# EAGLE schematic BEP32_6stencil_Seed_wMilling (EAGLE 6.4), part 3 of 4
## Sheet 9 of 12
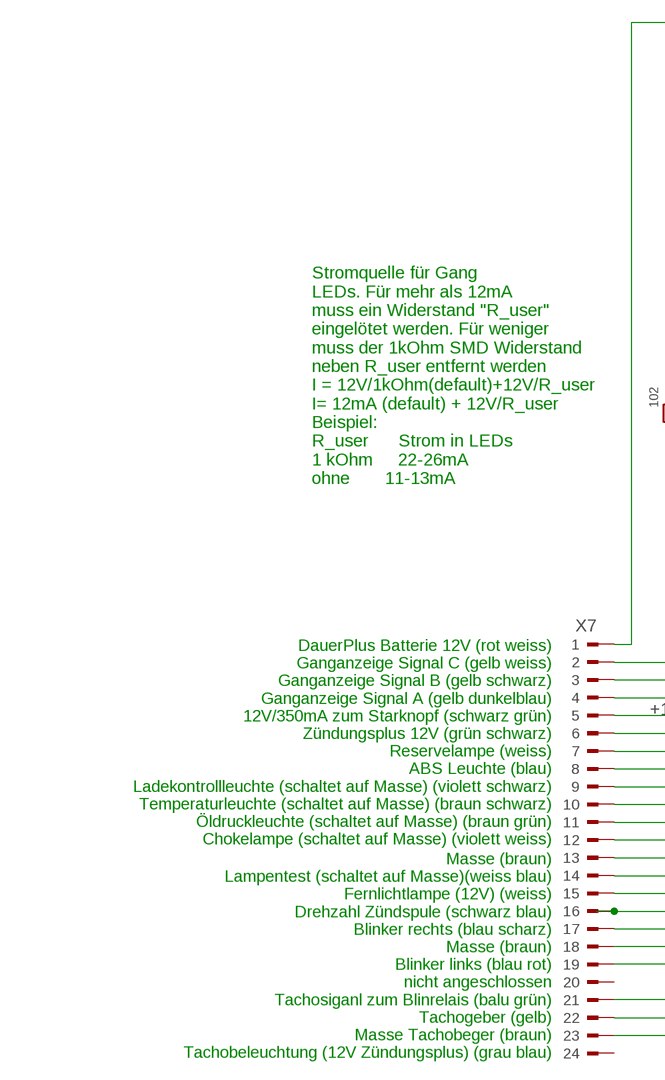
[diagram p16: schematic, sheet 9, part 1 of 2]
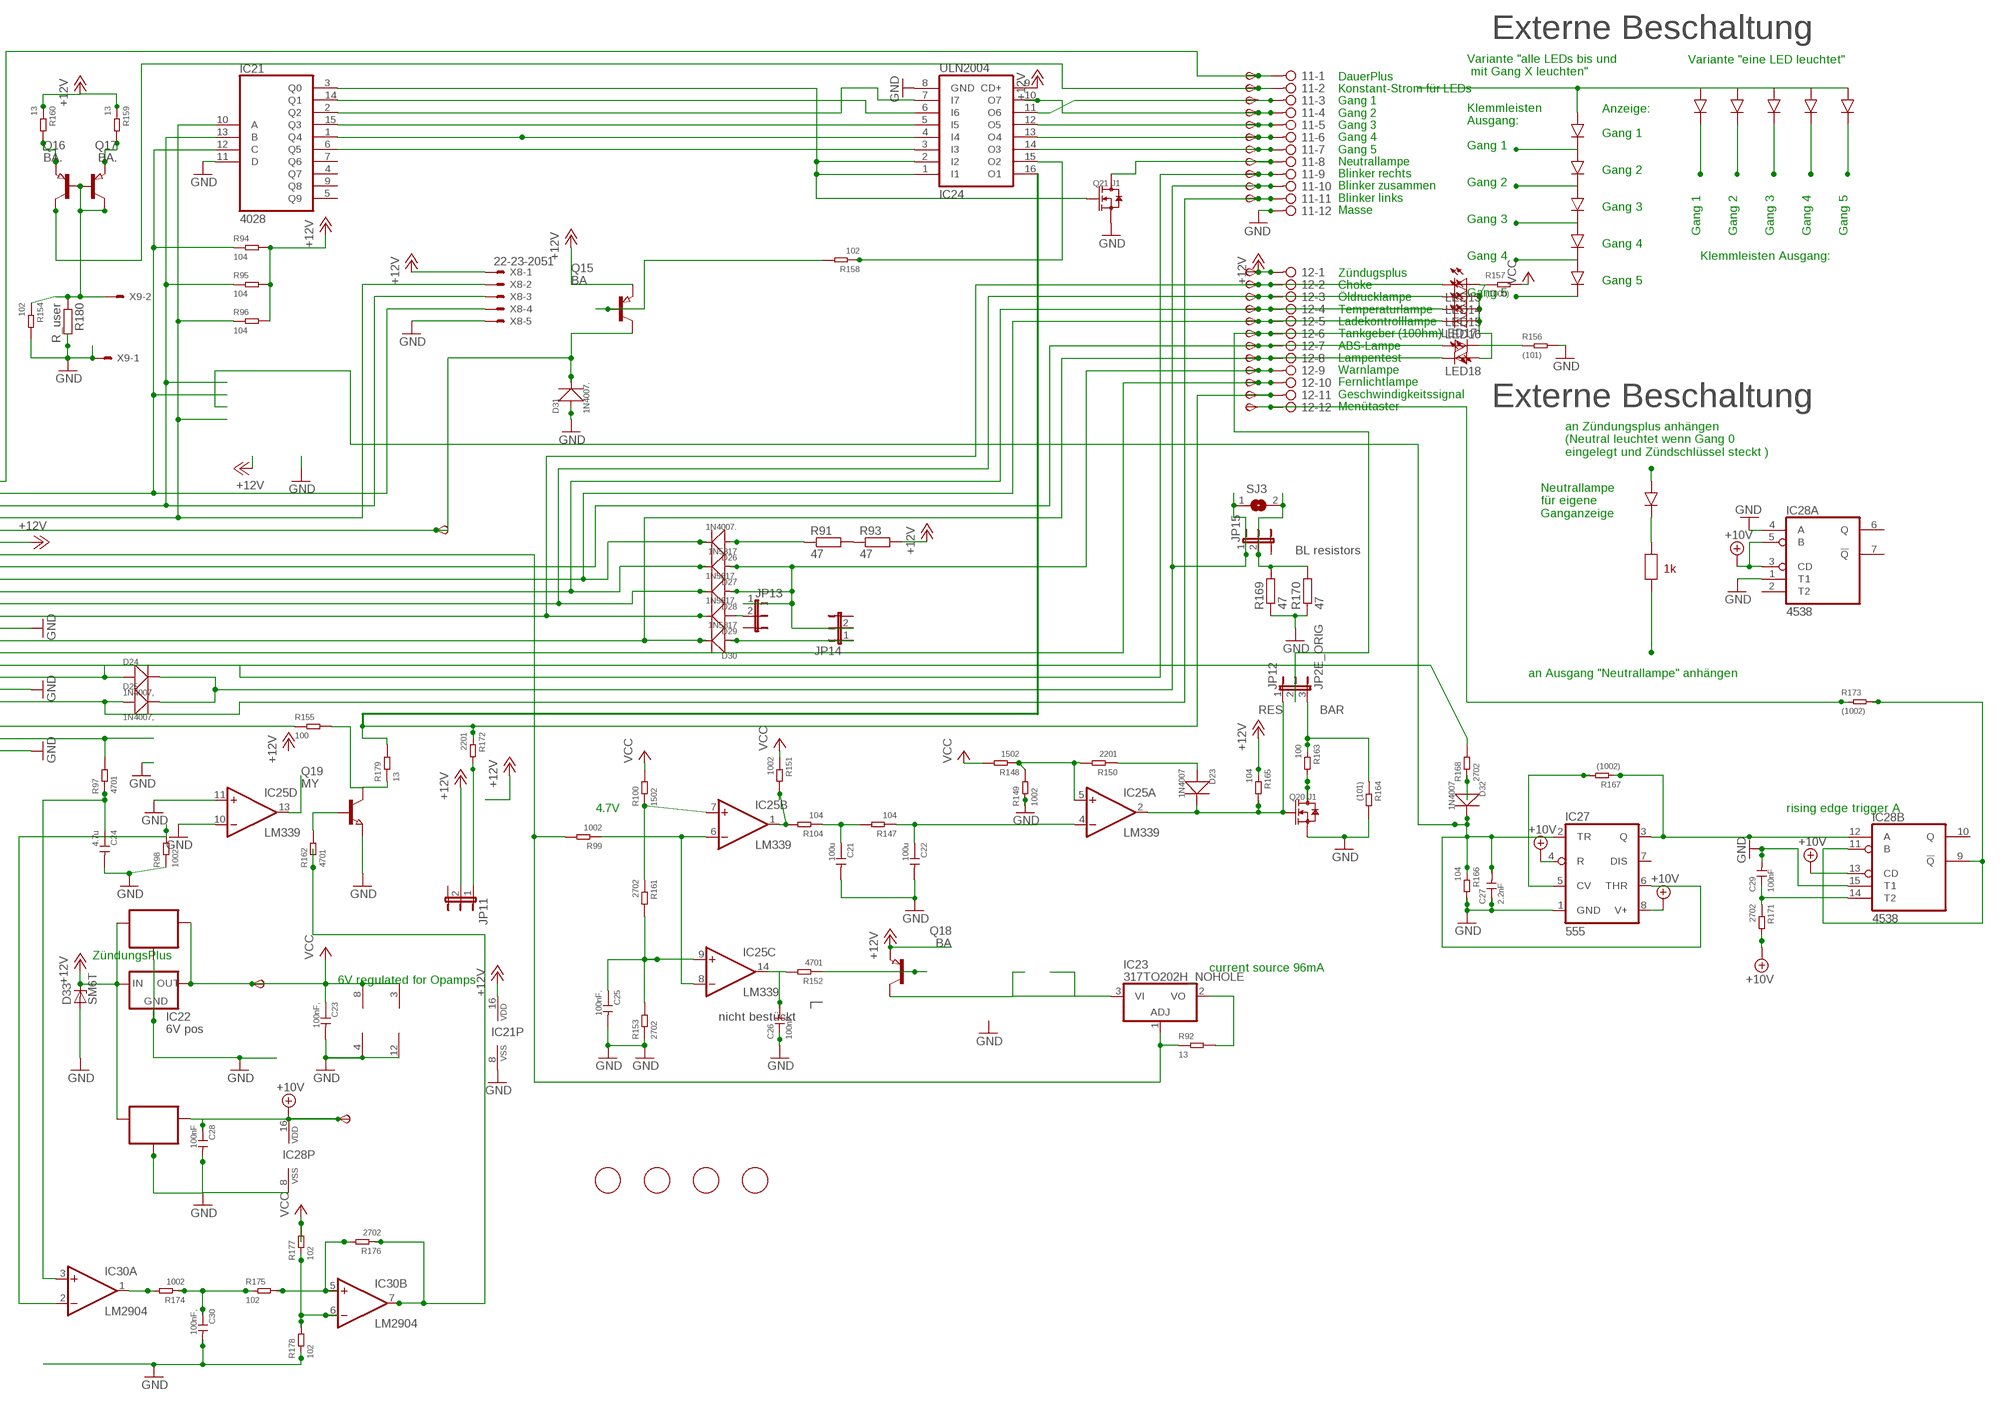
[diagram p17: schematic, sheet 9, part 2 of 2]

### Parts
6V3  TPSB2.0  [B2.0]
10V3  TPSB2.0  [B2.0]
11  2081-1132  [12-PIN]
12  2081-1132  [12-PIN]
C21  100u  CERAMIC-100UF-6.3V-20%-X5R(1206)  [C1206]
C22  100u  CERAMIC-100UF-6.3V-20%-X5R(1206)  [C1206]
C23  100nF,  CERAMIC-100NF-50V-10%-X7R(0805)  [C0805]
C24  4.7u  CERAMIC-4.7UF-25V-10%-X5R(0805)  [C0805]
C25  100nF.  CERAMIC-100NF-50V-10%-X7R(0805)  [C0805]
C26  100nF.  CERAMIC-100NF-50V-10%-X7R(0805)  [C0805]
C27  2.2nF  CERAMIC-100NF-50V-10%-X7R(0805)  [C0805]
C28  100nF  CERAMIC-100NF-50V-10%-X7R(0805)  [C0805]
C29  100nF  CERAMIC-100NF-50V-10%-X7R(0805)  [C0805]
C30  100nF,  CERAMIC-100NF-50V-10%-X7R(0805)  [C0805]
D23  1N4007  DIODE-GEN-PURPOSE-1KV-1A(DO-214AC)  [DO-214AC]
D24  1N4007,  DIODE-GEN-PURPOSE-1KV-1A(DO-214AC)  [DO-214AC]
D25  1N4007,  DIODE-GEN-PURPOSE-1KV-1A(DO-214AC)  [DO-214AC]
D26  1N4007.  DIODE-GEN-PURPOSE-1KV-1A(DO-214AC)  [DO-214AC]
D27  1N5817  DIODE-GEN-PURPOSE-1KV-1A(DO-214AC)DO-214AC/1206  [DO-214AC_SLIM]
D28  1N5817.  DIODE-GEN-PURPOSE-1KV-1A(DO-214AC)DO-214AC/1206  [DO-214AC_SLIM]
D29  1N5817.  DIODE-GEN-PURPOSE-1KV-1A(DO-214AC)DO-214AC/1206  [DO-214AC_SLIM]
D30  1N5817  DIODE-GEN-PURPOSE-1KV-1A(DO-214AC)DO-214AC/1206  [DO-214AC_SLIM]
D31  1N4007.  DIODE-GEN-PURPOSE-1KV-1A(DO-214AC)  [DO-214AC]
D32  1N4007  DIODE-GEN-PURPOSE-1KV-1A(DO-214AC)  [DO-214AC]
D33  SM6T  [DO214AA]
FID11  FIDUCIAL  [FIDUCIAL_1MM]
FID12  FIDUCIAL  [FIDUCIAL_1MM]
FID13  FIDUCIAL  [FIDUCIAL_1MM]
FID14  FIDUCIAL  [FIDUCIAL_1MM]
IC21  4028  4028D  [SO16]
IC22  6V pos  78LXX  [78LXX]
IC23  317TO202H_NOHOLE  [TO220H_NOHOLE]
IC24  ULN2004  ULN2004AD  [SO16]
IC25  LM339  LM339D  [SO14]
IC26  78L06  78LXXSOT89_ROUND  [SOT89_ROUND]
IC27  555  NE555D  [SO08]
IC28  4538  4538D  [SO16]
IC29  78L10  78LXXSOT89_ROUND  [SOT89_ROUND]
IC30  LM2904  LM358D  [SO08]
JP11  JP2EJP2_SMALLPADS  [JP2_SMALLPADS]
JP12  JP2E_ORIG  [JP2_ORIG_SMALLPADS]
JP13  JP2EJP2_SMALLPADS  [JP2_SMALLPADS]
JP14  JP2EJP2_SMALLPADS  [JP2_SMALLPADS]
JP15  JP2EJP2_SMALLPADS  [JP2_SMALLPADS]
LED13  LEDLD260  [LD260]
LED14  LEDLD260  [LD260]
LED15  LEDLD260  [LD260]
LED16  LEDLD260  [LD260]
LED17  LEDLD260  [LD260]
LED18  LEDLD260  [LD260]
Q15  BA  PNP-TRANSISTOR_SOT89  [SOT89]
Q16  BA.  PNP-TRANSISTOR_SOT89  [SOT89]
Q17  BA.  PNP-TRANSISTOR_SOT89  [SOT89]
Q18  BA  PNP-TRANSISTOR_SOT89  [SOT89]
Q19  MY  NPN-TRANSISTOR_SOT89  [SOT89]
Q20  J1  SMD-MOSFET-N-CH-50V-200MA-BSS138W-7-F(SOT-23)  [SOT-23]
Q21  J1  SMD-MOSFET-N-CH-50V-200MA-BSS138W-7-F(SOT-23)  [SOT-23]
R91  47  R-EU_V235/17_1MM  [V235/17_1MM]
R92  13  SMD-RES-13R-5%-1/4W(1206)  [R1206]
R93  47  R-EU_V235/17_1MM  [V235/17_1MM]
R94  104  SMD-RES-10K-1%-1/8W(0805)  [R0805]
R95  104  SMD-RES-10K-1%-1/8W(0805)  [R0805]
R96  104  SMD-RES-10K-1%-1/8W(0805)  [R0805]
R97  4701  SMD-RES-4.7K-5%-1/8W(0805)  [R0805]
R98  1002  SMD-RES-10K-1%-1/8W(0805)  [R0805]
R99  1002  SMD-RES-10K-1%-1/8W(0805)  [R0805]
R100  1502  SMD-RES-10K-1%-1/8W(0805)  [R0805]
R104  104  SMD-RES-10K-1%-1/8W(0805)  [R0805]
R147  104  SMD-RES-10K-1%-1/8W(0805)  [R0805]
R148  1502  SMD-RES-10K-1%-1/8W(0805)  [R0805]
R149  1002  SMD-RES-10K-1%-1/8W(0805)  [R0805]
R150  2201  SMD-RES-2.2K-5%-1/8W(0805)  [R0805]
R151  1002  SMD-RES-10K-1%-1/8W(0805)  [R0805]
R152  4701  SMD-RES-4.7K-5%-1/8W(0805)  [R0805]
R153  2702  SMD-RES-4.7K-5%-1/8W(0805)  [R0805]
R154  102  SMD-RES-1K-5%-1/8W(0805)  [R0805]
R155  100  SMD-RES-220R-5%-1/8W(0805)  [R0805]
R156  (101)  SMD-RES-100R-5%-1/8W(0805)  [R0805]
R157  (1000)  SMD-RES-100R-5%-1/8W(0805)  [R0805]
R158  102  SMD-RES-1K-5%-1/8W(0805)  [R0805]
R159  13  SMD-RES-13R-5%-1/4W(1206)  [R1206]
R160  13  SMD-RES-13R-5%-1/4W(1206)  [R1206]
R161  2702  SMD-RES-4.7K-5%-1/8W(0805)  [R0805]
R162  4701  SMD-RES-4.7K-5%-1/8W(0805)  [R0805]
R163  100  SMD-RES-2.2K-5%-1/8W(0805)  [R0805]
R164  (101)  SMD-RES-2.2K-5%-1/8W(0805)  [R0805]
R165  104  SMD-RES-10K-1%-1/8W(0805)  [R0805]
R166  104  SMD-RES-10K-1%-1/8W(0805)  [R0805]
R167  (1002)  SMD-RES-10K-1%-1/8W(0805)  [R0805]
R168  2702  SMD-RES-10K-1%-1/8W(0805)  [R0805]
R169  47  R-EU_V235/17_1MM  [V235/17_1MM]
R170  47  R-EU_V235/17_1MM  [V235/17_1MM]
R171  2702  SMD-RES-4.7K-5%-1/8W(0805)  [R0805]
R172  2201  SMD-RES-2.2K-5%-1/8W(0805)  [R0805]
R173  (1002)  SMD-RES-4.7K-5%-1/8W(0805)  [R0805]
R174  1002  SMD-RES-10K-1%-1/8W(0805)  [R0805]
R175  102  SMD-RES-1K-5%-1/8W(0805)  [R0805]
R176  2702  SMD-RES-4.7K-5%-1/8W(0805)  [R0805]
R177  102  SMD-RES-1K-5%-1/8W(0805)  [R0805]
R178  102  SMD-RES-1K-5%-1/8W(0805)  [R0805]
R179  13  SMD-RES-13R-5%-1/4W(1206)  [R1206]
R180  R_user  R-EU_R0805  [R0805]
SJ3  SJ  [SJ]
START3  TPSB2.0  [B2.0]
TP116  TPSB2.0  [B2.0]
TP117  TPSB2.0  [B2.0]
TP118  TPSB2.0  [B2.0]
TP119  TPSB2.0  [B2.0]
TP120  TPSB2.0  [B2.0]
TP121  TPSB2.0  [B2.0]
TP122  TPSB2.0  [B2.0]
TP123  TPSB2.0  [B2.0]
TP124  TPSB2.0  [B2.0]
TP125  TPSB2.0  [B2.0]
TP126  TPSB2.0  [B2.0]
TP127  TPSB2.0  [B2.0]
TP128  TPSB2.0  [B2.0]
TP129  TPSB2.0  [B2.0]
TP130  TPSB2.0  [B2.0]
TP131  TPSB2.0  [B2.0]
TP132  TPSB2.0  [B2.0]
TP133  TPSB2.0  [B2.0]
TP134  TPSB1,27  [B1,27]
TP135  TPSB2.0  [B2.0]
TP136  TPSB2.0  [B2.0]
TP137  TPSB2.0  [B2.0]
TP138  TPSB2.0  [B2.0]
X7  CON_BMWV2  [24-PIN_V2]
X8  22-23-2051  [22-23-2051]
X9  22-23-2021  [22-23-2021]

### Nets
+10V: 10V3.TP(PP) C28.1 IC27.4(R) IC27.8(V+) IC28.3(A:CD) IC28.5(A:B) IC28.13(B:CD) IC28.16(P:VDD) IC29.1(OUT) R171.2 ; also sheet 1,2,3,4,5,6,7,8,10,11,12
+12V: 12.1 D33.C IC21.16(VDD) IC22.IN IC24.9(CD+) IC26.3(IN) IC29.3(IN) JP11.2 Q15.3(E) Q18.3(E) R93.2 R94.2 R95.2 R96.2 R159.1 R160.1 R165.1 TP137.TP(PP) X7.6 X8.1 ; also sheet 1,2,3,4,5,6,7,8,10,11,12
+12V6: IC30.7(B:OUT) R162.1 R176.1
GND: 11.12 C21.2 C22.2 C23.2 C24.2 C25.2 C26.1 C27.1 C28.2 C29.2 C30.2 D31.1(+) D33.A IC21.8(VSS) IC21.11(D) IC22.GND IC24.8(GND) IC25.10(D:-IN) IC25.11(D:+IN) IC25.12(P:GND) IC26.2(GND) IC26.2@1(GND) IC27.1(GND) IC28.1(A:T1) IC28.4(A:A) IC28.8(P:VSS) IC28.15(B:T1) IC29.2(GND) IC29.2@1(GND) IC30.4(P:V-) Q19.3(E) Q20.2(S) Q21.2(S) R98.1 R149.1 R153.1 R154.2 R156.2 R164.2 R166.2 R169.1 R170.1 R178.1 R180.2 X7.13 X7.18 X7.23 X8.5 X9.1 ; also sheet 1,2,3,4,5,6,7,8,10,11,12
N$481: R91.2 R93.1
N$482: 12.9 D27.1(+) D28.1(+) JP13.1 JP14.2 TP134.TP(PP)
N$483: IC21.10(A) R96.1 X7.4 X8.2
N$484: IC21.13(B) R95.1 X7.3 X8.3
N$485: D31.2(-) Q15.2(C) START3.TP(PP) X7.5
N$486: IC21.12(C) R94.1 X7.2 X8.4
N$487: 12.7 LED17.A TP132.TP(PP) X7.8
N$488: 12.2 D29.2(-) LED13.K(C) TP127.TP(PP) X7.12
N$489: 12.3 D28.2(-) LED14.K(C) TP128.TP(PP) X7.11
N$490: 12.4 D27.2(-) LED15.K(C) TP129.TP(PP) X7.10
N$491: 12.8 D30.2(-) LED18.K(C) TP133.TP(PP) X7.14
N$492: 11.9 D24.1(+) TP124.TP(PP) X7.17
N$493: 11.11 D25.1(+) TP126.TP(PP) X7.19
N$494: R97.2 X7.22
N$495: C24.1 IC30.3(A:+IN) R97.1
N$496: 12.11 IC24.16(O1) R172.1 R179.2 TP136.TP(PP)
N$497: IC25.1(B:OUT) R104.2 R151.2
N$498: C21.1 R104.1 R147.2
N$499: C22.1 IC25.4(A:-IN) R147.1
N$500: IC25.5(A:+IN) R148.1 R149.2 R150.2
N$501: D23.1(+) R150.1
N$502: C25.1 IC25.9(C:+IN) R153.2 R161.2
N$503: C26.2 IC25.14(C:OUT) R152.2
N$504: Q18.1(B) R152.1
N$505: IC21.2(Q2) IC24.7(I7)
N$506: 11.5 IC24.12(O5) TP120.TP(PP)
N$507: IC21.1(Q4) IC24.4(I4)
N$508: 11.8 Q21.3(D) TP123.TP(PP)
N$509: 12.10 TP135.TP(PP) X7.15
N$510: 12.5 D26.2(-) LED16.K(C) TP130.TP(PP) X7.9
N$511: D26.1(+) R91.1
N$512: IC21.6(Q5) IC24.3(I3)
N$513: 11.4 IC24.10(O7) TP119.TP(PP)
N$514: IC23.1(ADJ) R92.1 R99.2 X7.7
N$515: IC25.6(B:-IN) IC25.8(C:-IN) R99.1
N$516: 11.2 Q17.2(C) TP117.TP(PP)
N$517: 11.1 TP116.TP(PP) X7.1
N$531: R168.2 X7.16
N$532: IC21.15(Q3) IC24.5(I5)
N$533: 11.6 IC24.13(O4) TP121.TP(PP)
N$534: 11.7 IC24.14(O3) TP122.TP(PP)
N$535: 12.6 JP12.2 TP131.TP(PP)
N$536: LED17.K(C) R156.1
N$537: LED13.A LED14.A LED15.A LED16.A LED18.A R157.1
N$538: Q15.1(B) R158.2
N$539: IC21.3(Q0) IC24.1(I1) IC24.2(I2) Q21.1(G)
N$540: IC21.14(Q1) IC24.6(I6)
N$541: 11.3 IC24.11(O6) TP118.TP(PP)
N$542: Q16.1(B) Q16.2(C) Q17.1(B) R154.1 R180.1 X9.2
N$543: Q17.3(E) R160.2
N$544: Q16.3(E) R159.2
N$545: IC25.7(B:+IN) R100.1 R161.1
N$546: IC30.2(A:-IN) R98.2
N$547: Q19.1(B) R162.2
N$548: Q20.3(D) R163.2
N$549: IC23.2(VO) R92.2
N$550: IC23.3(VI) Q18.2(C)
N$551: C27.2 D32.2(-) IC27.2(TR) IC27.6(THR) R166.1
N$552: IC27.5(CV) R167.2
N$553: IC27.3(Q) IC28.12(B:A) R167.1
N$554: D32.1(+) R168.1
N$555: 11.10 D24.2(-) D25.2(-) JP15.1 SJ3.1 TP125.TP(PP)
N$556: JP15.2 R169.2 R170.2 SJ3.2
N$557: IC28.9(B:!Q) IC28.11(B:B) R173.2
N$558: C29.1 IC28.14(B:T2) R171.1
N$559: JP11.1 R172.2
N$560: IC24.15(O2) R158.1
N$561: 12.12 R173.1 TP138.TP(PP)
N$562: D29.1(+) JP13.2
N$563: D23.2(-) IC25.2(A:OUT) JP12.1 Q20.1(G) R165.2
N$564: IC30.1(A:OUT) R174.2
N$565: C30.1 R174.1 R175.1
N$566: IC30.5(B:+IN) R175.2 R176.2
N$567: IC30.6(B:-IN) R177.1 R178.2
N$568: D30.1(+) JP14.1
N$569: JP12.3 R163.1 R164.1
N$570: IC25.13(D:OUT)
N$571: R155.1 X7.21
N$572: Q19.2(C) R155.2 R179.1
VCC: 6V3.TP(PP) C23.1 IC22.OUT IC25.3(P:V+) IC26.1(OUT) IC30.8(P:V+) R100.2 R148.2 R151.1 R157.2 R177.2 ; also sheet 1,2,3,4,5,6,7,8,10,11,12
Unconnected: IC21.4(Q7) IC21.5(Q9) IC21.7(Q6) IC21.9(Q8) IC27.7(DIS) IC28.2(A:T2) IC28.6(A:Q) IC28.7(A:!Q) IC28.10(B:Q) X7.20 X7.24

### Notes on the sheet
- Externe Beschaltung
- Variante "eine LED leuchtet"
- Variante "alle LEDs bis und
   mit Gang X leuchten"
- Anzeige:
- Klemmleisten
  Ausgang:
- Gang 1
- DauerPlus
  Konstant-Strom für LEDs
  Gang 1
  Gang 2
  Gang 3
  Gang 4
  Gang 5
  Neutrallampe
  Blinker rechts
  Blinker zusammen
  Blinker links
  Masse
- Gang 1
- Gang 2
- Gang 2
- Gang 3
- Gang 3
- Gang 1 | Gang 2 | Gang 3 | Gang 4 | Gang 5
- Gang 4
- Gang 4 | Klemmleisten Ausgang:
- Gang 5
- Gang 5
- Zündugsplus
  Choke
  Öldrucklampe
  Temperaturlampe
  Ladekontrolllampe
  Tankgeber (100hm)
  ABS-Lampe
  Lampentest
  Warnlampe
  Fernlichtlampe
  Geschwindigkeitssignal
  Menütaster
- Stromquelle für Gang
  LEDs. Für mehr als 12mA
  muss ein Widerstand "R_user"
  eingelötet werden. Für weniger
  muss der 1kOhm SMD Widerstand
  neben R_user entfernt werden
  I = 12V/1kOhm(default)+12V/R_user
  I= 12mA (default) + 12V/R_user
  Beispiel:
  R_user      Strom in LEDs
  1 kOhm     22-26mA
  ohne       11-13mA
- Externe Beschaltung
- an Zündungsplus anhängen
  (Neutral leuchtet wenn Gang 0
  eingelegt und Zündschlüssel steckt )
- Neutrallampe
  für eigene
  Ganganzeige
- DauerPlus Batterie 12V (rot weiss)
  Ganganzeige Signal C (gelb weiss)
  Ganganzeige Signal B (gelb schwarz)
  Ganganzeige Signal A (gelb dunkelblau)
  12V/350mA zum Starknopf (schwarz grün)
  Zündungsplus 12V (grün schwarz)
  Reservelampe (weiss)
  ABS Leuchte (blau)
  Ladekontrollleuchte (schaltet auf Masse) (violett schwarz)
  Temperaturleuchte (schaltet auf Masse) (braun schwarz)
  Öldruckleuchte (schaltet auf Masse) (braun grün)
  Chokelampe (schaltet auf Masse) (violett weiss)
- BL resistors
- 1k
- an Ausgang "Neutrallampe" anhängen
- Masse (braun)
  Lampentest (schaltet auf Masse)(weiss blau)
  Fernlichtlampe (12V) (weiss)
  Drehzahl Zündspule (schwarz blau)
  Blinker rechts (blau scharz)
  Masse (braun)
  Blinker links (blau rot)
  nicht angeschlossen
  Tachosiganl zum Blinrelais (balu grün)
  Tachogeber (gelb)
  Masse Tachobeger (braun)
  Tachobeleuchtung (12V Zündungsplus) (grau blau)
- RES | BAR
- 4.7V | rising edge trigger A
- ZündungsPlus
- current source 96mA
- 6V regulated for Opamps
- nicht bestückt

## Sheet 10 of 12
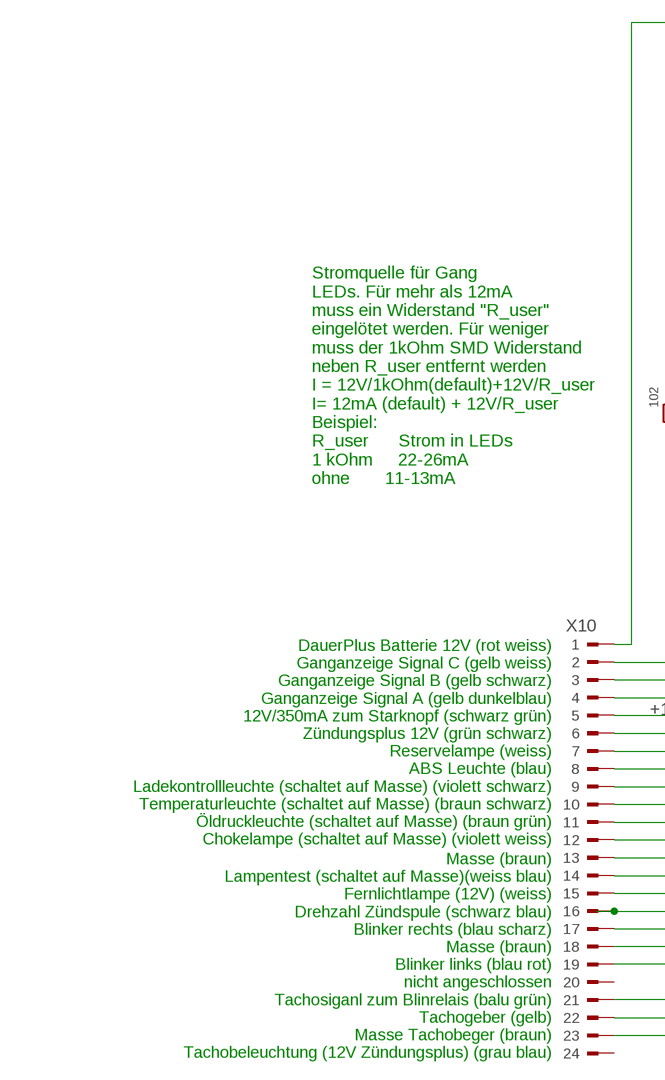
[diagram p18: schematic, sheet 10, part 1 of 2]
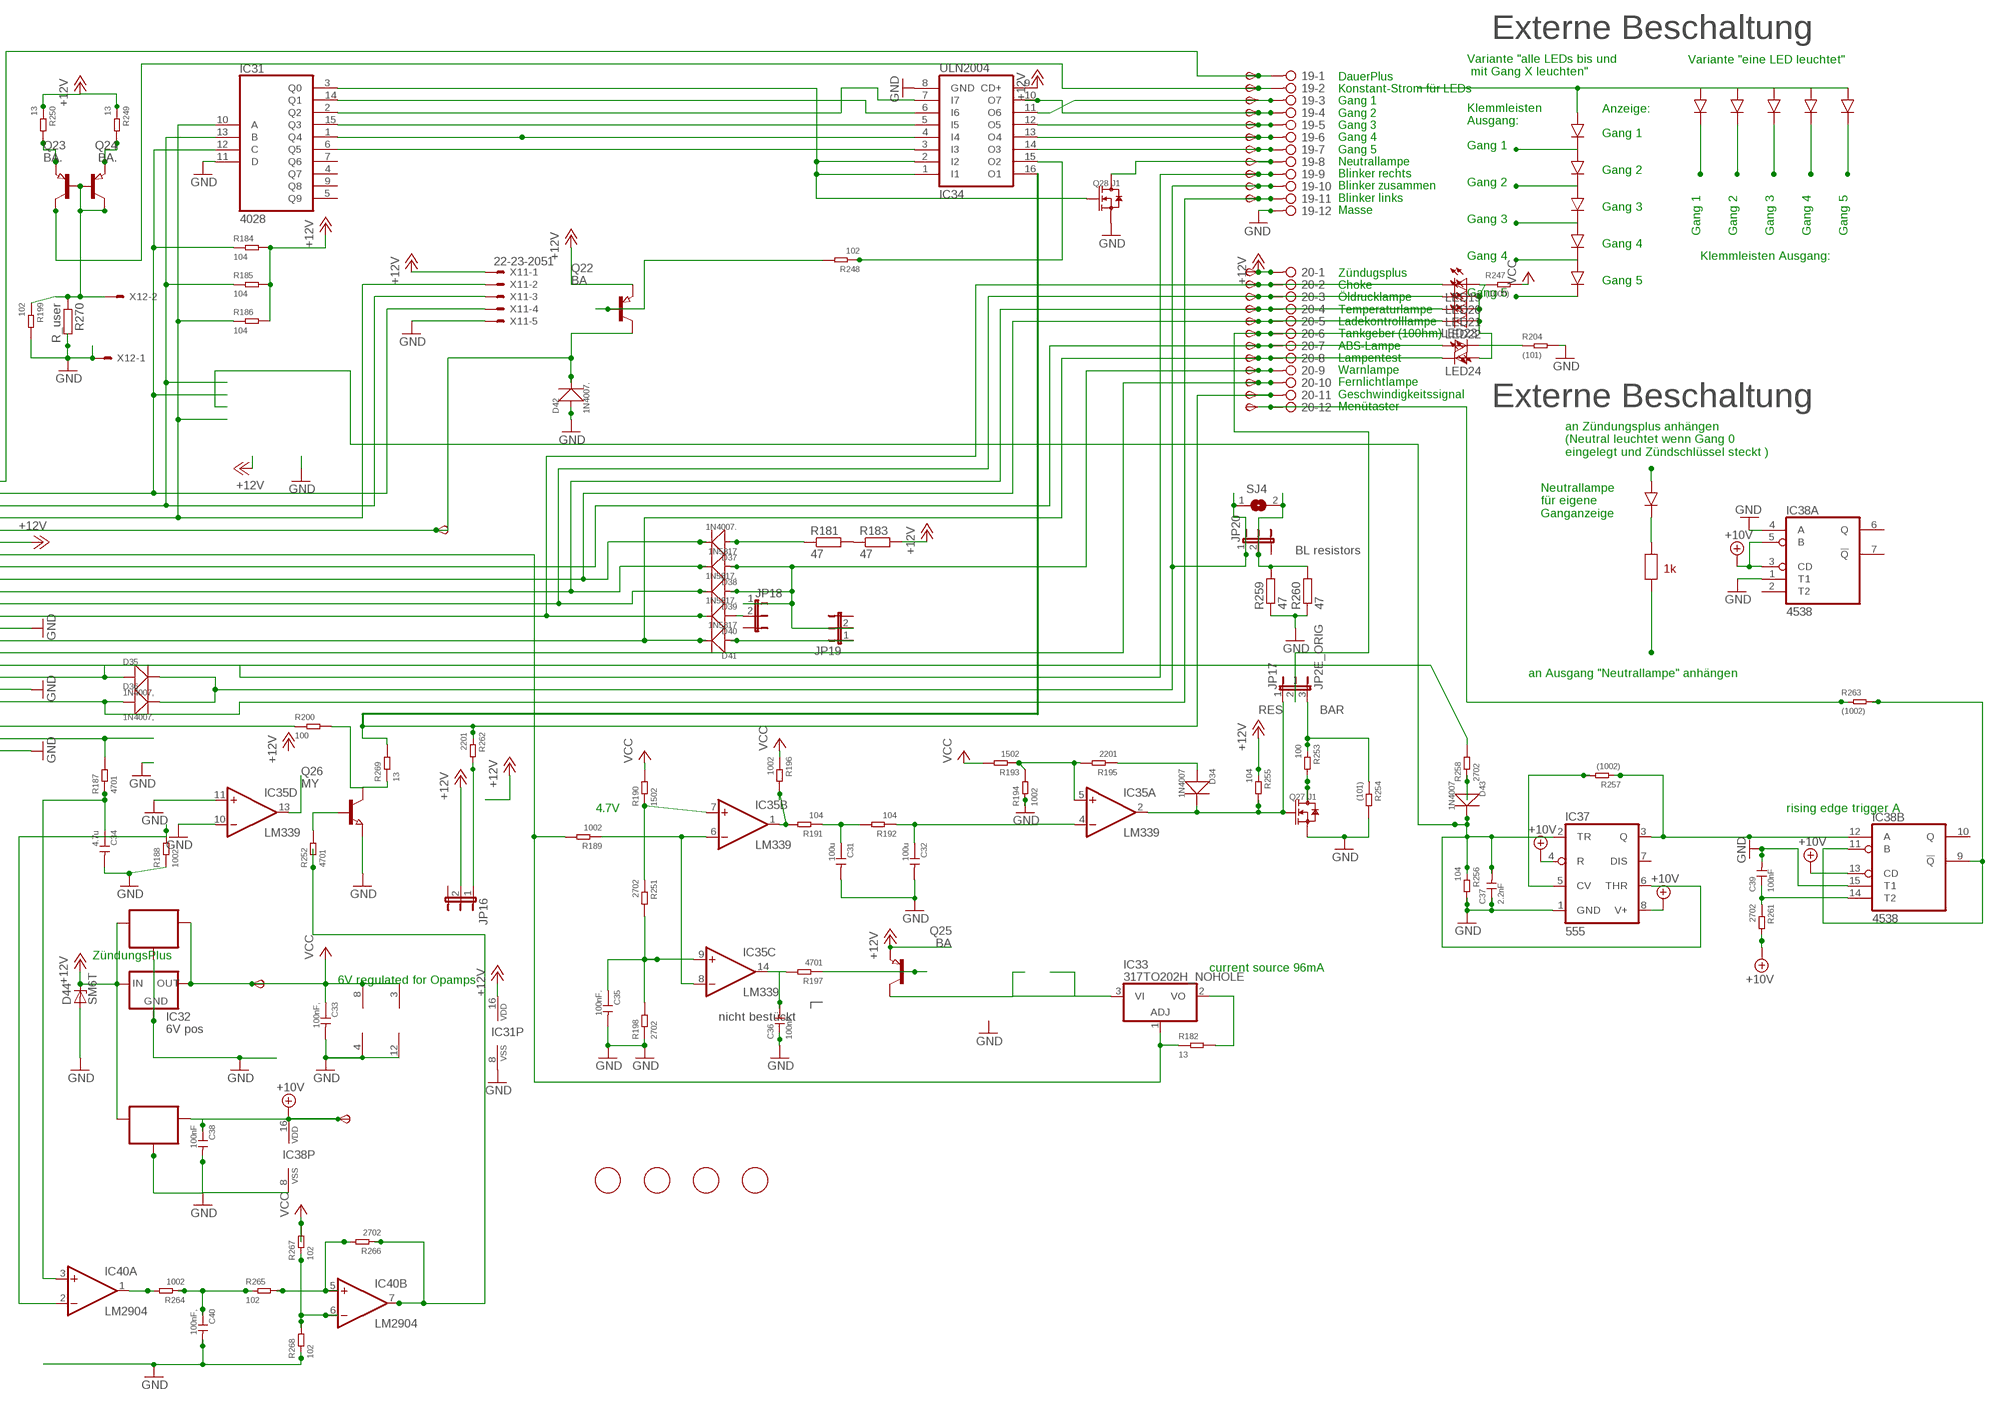
[diagram p19: schematic, sheet 10, part 2 of 2]

### Parts
6V4  TPSB2.0  [B2.0]
10V4  TPSB2.0  [B2.0]
19  2081-1132  [12-PIN]
20  2081-1132  [12-PIN]
C31  100u  CERAMIC-100UF-6.3V-20%-X5R(1206)  [C1206]
C32  100u  CERAMIC-100UF-6.3V-20%-X5R(1206)  [C1206]
C33  100nF,  CERAMIC-100NF-50V-10%-X7R(0805)  [C0805]
C34  4.7u  CERAMIC-4.7UF-25V-10%-X5R(0805)  [C0805]
C35  100nF.  CERAMIC-100NF-50V-10%-X7R(0805)  [C0805]
C36  100nF.  CERAMIC-100NF-50V-10%-X7R(0805)  [C0805]
C37  2.2nF  CERAMIC-100NF-50V-10%-X7R(0805)  [C0805]
C38  100nF  CERAMIC-100NF-50V-10%-X7R(0805)  [C0805]
C39  100nF  CERAMIC-100NF-50V-10%-X7R(0805)  [C0805]
C40  100nF,  CERAMIC-100NF-50V-10%-X7R(0805)  [C0805]
D34  1N4007  DIODE-GEN-PURPOSE-1KV-1A(DO-214AC)  [DO-214AC]
D35  1N4007,  DIODE-GEN-PURPOSE-1KV-1A(DO-214AC)  [DO-214AC]
D36  1N4007,  DIODE-GEN-PURPOSE-1KV-1A(DO-214AC)  [DO-214AC]
D37  1N4007.  DIODE-GEN-PURPOSE-1KV-1A(DO-214AC)  [DO-214AC]
D38  1N5817  DIODE-GEN-PURPOSE-1KV-1A(DO-214AC)DO-214AC/1206  [DO-214AC_SLIM]
D39  1N5817.  DIODE-GEN-PURPOSE-1KV-1A(DO-214AC)DO-214AC/1206  [DO-214AC_SLIM]
D40  1N5817.  DIODE-GEN-PURPOSE-1KV-1A(DO-214AC)DO-214AC/1206  [DO-214AC_SLIM]
D41  1N5817  DIODE-GEN-PURPOSE-1KV-1A(DO-214AC)DO-214AC/1206  [DO-214AC_SLIM]
D42  1N4007.  DIODE-GEN-PURPOSE-1KV-1A(DO-214AC)  [DO-214AC]
D43  1N4007  DIODE-GEN-PURPOSE-1KV-1A(DO-214AC)  [DO-214AC]
D44  SM6T  [DO214AA]
FID15  FIDUCIAL  [FIDUCIAL_1MM]
FID16  FIDUCIAL  [FIDUCIAL_1MM]
FID17  FIDUCIAL  [FIDUCIAL_1MM]
FID18  FIDUCIAL  [FIDUCIAL_1MM]
IC31  4028  4028D  [SO16]
IC32  6V pos  78LXX  [78LXX]
IC33  317TO202H_NOHOLE  [TO220H_NOHOLE]
IC34  ULN2004  ULN2004AD  [SO16]
IC35  LM339  LM339D  [SO14]
IC36  78L06  78LXXSOT89_ROUND  [SOT89_ROUND]
IC37  555  NE555D  [SO08]
IC38  4538  4538D  [SO16]
IC39  78L10  78LXXSOT89_ROUND  [SOT89_ROUND]
IC40  LM2904  LM358D  [SO08]
JP16  JP2EJP2_SMALLPADS  [JP2_SMALLPADS]
JP17  JP2E_ORIG  [JP2_ORIG_SMALLPADS]
JP18  JP2EJP2_SMALLPADS  [JP2_SMALLPADS]
JP19  JP2EJP2_SMALLPADS  [JP2_SMALLPADS]
JP20  JP2EJP2_SMALLPADS  [JP2_SMALLPADS]
LED19  LEDLD260  [LD260]
LED20  LEDLD260  [LD260]
LED21  LEDLD260  [LD260]
LED22  LEDLD260  [LD260]
LED23  LEDLD260  [LD260]
LED24  LEDLD260  [LD260]
Q22  BA  PNP-TRANSISTOR_SOT89  [SOT89]
Q23  BA.  PNP-TRANSISTOR_SOT89  [SOT89]
Q24  BA.  PNP-TRANSISTOR_SOT89  [SOT89]
Q25  BA  PNP-TRANSISTOR_SOT89  [SOT89]
Q26  MY  NPN-TRANSISTOR_SOT89  [SOT89]
Q27  J1  SMD-MOSFET-N-CH-50V-200MA-BSS138W-7-F(SOT-23)  [SOT-23]
Q28  J1  SMD-MOSFET-N-CH-50V-200MA-BSS138W-7-F(SOT-23)  [SOT-23]
R181  47  R-EU_V235/17_1MM  [V235/17_1MM]
R182  13  SMD-RES-13R-5%-1/4W(1206)  [R1206]
R183  47  R-EU_V235/17_1MM  [V235/17_1MM]
R184  104  SMD-RES-10K-1%-1/8W(0805)  [R0805]
R185  104  SMD-RES-10K-1%-1/8W(0805)  [R0805]
R186  104  SMD-RES-10K-1%-1/8W(0805)  [R0805]
R187  4701  SMD-RES-4.7K-5%-1/8W(0805)  [R0805]
R188  1002  SMD-RES-10K-1%-1/8W(0805)  [R0805]
R189  1002  SMD-RES-10K-1%-1/8W(0805)  [R0805]
R190  1502  SMD-RES-10K-1%-1/8W(0805)  [R0805]
R191  104  SMD-RES-10K-1%-1/8W(0805)  [R0805]
R192  104  SMD-RES-10K-1%-1/8W(0805)  [R0805]
R193  1502  SMD-RES-10K-1%-1/8W(0805)  [R0805]
R194  1002  SMD-RES-10K-1%-1/8W(0805)  [R0805]
R195  2201  SMD-RES-2.2K-5%-1/8W(0805)  [R0805]
R196  1002  SMD-RES-10K-1%-1/8W(0805)  [R0805]
R197  4701  SMD-RES-4.7K-5%-1/8W(0805)  [R0805]
R198  2702  SMD-RES-4.7K-5%-1/8W(0805)  [R0805]
R199  102  SMD-RES-1K-5%-1/8W(0805)  [R0805]
R200  100  SMD-RES-220R-5%-1/8W(0805)  [R0805]
R204  (101)  SMD-RES-100R-5%-1/8W(0805)  [R0805]
R247  (1000)  SMD-RES-100R-5%-1/8W(0805)  [R0805]
R248  102  SMD-RES-1K-5%-1/8W(0805)  [R0805]
R249  13  SMD-RES-13R-5%-1/4W(1206)  [R1206]
R250  13  SMD-RES-13R-5%-1/4W(1206)  [R1206]
R251  2702  SMD-RES-4.7K-5%-1/8W(0805)  [R0805]
R252  4701  SMD-RES-4.7K-5%-1/8W(0805)  [R0805]
R253  100  SMD-RES-2.2K-5%-1/8W(0805)  [R0805]
R254  (101)  SMD-RES-2.2K-5%-1/8W(0805)  [R0805]
R255  104  SMD-RES-10K-1%-1/8W(0805)  [R0805]
R256  104  SMD-RES-10K-1%-1/8W(0805)  [R0805]
R257  (1002)  SMD-RES-10K-1%-1/8W(0805)  [R0805]
R258  2702  SMD-RES-10K-1%-1/8W(0805)  [R0805]
R259  47  R-EU_V235/17_1MM  [V235/17_1MM]
R260  47  R-EU_V235/17_1MM  [V235/17_1MM]
R261  2702  SMD-RES-4.7K-5%-1/8W(0805)  [R0805]
R262  2201  SMD-RES-2.2K-5%-1/8W(0805)  [R0805]
R263  (1002)  SMD-RES-4.7K-5%-1/8W(0805)  [R0805]
R264  1002  SMD-RES-10K-1%-1/8W(0805)  [R0805]
R265  102  SMD-RES-1K-5%-1/8W(0805)  [R0805]
R266  2702  SMD-RES-4.7K-5%-1/8W(0805)  [R0805]
R267  102  SMD-RES-1K-5%-1/8W(0805)  [R0805]
R268  102  SMD-RES-1K-5%-1/8W(0805)  [R0805]
R269  13  SMD-RES-13R-5%-1/4W(1206)  [R1206]
R270  R_user  R-EU_R0805  [R0805]
SJ4  SJ  [SJ]
START4  TPSB2.0  [B2.0]
TP208  TPSB2.0  [B2.0]
TP209  TPSB2.0  [B2.0]
TP210  TPSB2.0  [B2.0]
TP211  TPSB2.0  [B2.0]
TP212  TPSB2.0  [B2.0]
TP213  TPSB2.0  [B2.0]
TP214  TPSB2.0  [B2.0]
TP215  TPSB2.0  [B2.0]
TP216  TPSB2.0  [B2.0]
TP217  TPSB2.0  [B2.0]
TP218  TPSB2.0  [B2.0]
TP219  TPSB2.0  [B2.0]
TP220  TPSB2.0  [B2.0]
TP221  TPSB2.0  [B2.0]
TP222  TPSB2.0  [B2.0]
TP223  TPSB2.0  [B2.0]
TP224  TPSB2.0  [B2.0]
TP225  TPSB2.0  [B2.0]
TP226  TPSB1,27  [B1,27]
TP227  TPSB2.0  [B2.0]
TP228  TPSB2.0  [B2.0]
TP229  TPSB2.0  [B2.0]
TP230  TPSB2.0  [B2.0]
X10  CON_BMWV2  [24-PIN_V2]
X11  22-23-2051  [22-23-2051]
X12  22-23-2021  [22-23-2021]

### Nets
+10V: 10V4.TP(PP) C38.1 IC37.4(R) IC37.8(V+) IC38.3(A:CD) IC38.5(A:B) IC38.13(B:CD) IC38.16(P:VDD) IC39.1(OUT) R261.2 ; also sheet 1,2,3,4,5,6,7,8,9,11,12
+12V: 20.1 D44.C IC31.16(VDD) IC32.IN IC34.9(CD+) IC36.3(IN) IC39.3(IN) JP16.2 Q22.3(E) Q25.3(E) R183.2 R184.2 R185.2 R186.2 R249.1 R250.1 R255.1 TP229.TP(PP) X10.6 X11.1 ; also sheet 1,2,3,4,5,6,7,8,9,11,12
+12V10: IC40.7(B:OUT) R252.1 R266.1
GND: 19.12 C31.2 C32.2 C33.2 C34.2 C35.2 C36.1 C37.1 C38.2 C39.2 C40.2 D42.1(+) D44.A IC31.8(VSS) IC31.11(D) IC32.GND IC34.8(GND) IC35.10(D:-IN) IC35.11(D:+IN) IC35.12(P:GND) IC36.2(GND) IC36.2@1(GND) IC37.1(GND) IC38.1(A:T1) IC38.4(A:A) IC38.8(P:VSS) IC38.15(B:T1) IC39.2(GND) IC39.2@1(GND) IC40.4(P:V-) Q26.3(E) Q27.2(S) Q28.2(S) R188.1 R194.1 R198.1 R199.2 R204.2 R254.2 R256.2 R259.1 R260.1 R268.1 R270.2 X10.13 X10.18 X10.23 X11.5 X12.1 ; also sheet 1,2,3,4,5,6,7,8,9,11,12
N$578: R181.2 R183.1
N$579: 20.9 D38.1(+) D39.1(+) JP18.1 JP19.2 TP226.TP(PP)
N$586: IC31.10(A) R186.1 X10.4 X11.2
N$587: IC31.13(B) R185.1 X10.3 X11.3
N$593: D42.2(-) Q22.2(C) START4.TP(PP) X10.5
N$594: IC31.12(C) R184.1 X10.2 X11.4
N$892: 20.7 LED23.A TP224.TP(PP) X10.8
N$893: 20.2 D40.2(-) LED19.K(C) TP219.TP(PP) X10.12
N$894: 20.3 D39.2(-) LED20.K(C) TP220.TP(PP) X10.11
N$895: 20.4 D38.2(-) LED21.K(C) TP221.TP(PP) X10.10
N$896: 20.8 D41.2(-) LED24.K(C) TP225.TP(PP) X10.14
N$897: 19.9 D35.1(+) TP216.TP(PP) X10.17
N$898: 19.11 D36.1(+) TP218.TP(PP) X10.19
N$899: R187.2 X10.22
N$900: C34.1 IC40.3(A:+IN) R187.1
N$901: 20.11 IC34.16(O1) R262.1 R269.2 TP228.TP(PP)
N$902: IC35.1(B:OUT) R191.2 R196.2
N$903: C31.1 R191.1 R192.2
N$904: C32.1 IC35.4(A:-IN) R192.1
N$905: IC35.5(A:+IN) R193.1 R194.2 R195.2
N$906: D34.1(+) R195.1
N$907: C35.1 IC35.9(C:+IN) R198.2 R251.2
N$908: C36.2 IC35.14(C:OUT) R197.2
N$909: Q25.1(B) R197.1
N$910: IC31.2(Q2) IC34.7(I7)
N$911: 19.5 IC34.12(O5) TP212.TP(PP)
N$912: IC31.1(Q4) IC34.4(I4)
N$913: 19.8 Q28.3(D) TP215.TP(PP)
N$914: 20.10 TP227.TP(PP) X10.15
N$915: 20.5 D37.2(-) LED22.K(C) TP222.TP(PP) X10.9
N$916: D37.1(+) R181.1
N$917: IC31.6(Q5) IC34.3(I3)
N$918: 19.4 IC34.10(O7) TP211.TP(PP)
N$919: IC33.1(ADJ) R182.1 R189.2 X10.7
N$920: IC35.6(B:-IN) IC35.8(C:-IN) R189.1
N$921: 19.2 Q24.2(C) TP209.TP(PP)
N$922: 19.1 TP208.TP(PP) X10.1
N$936: R258.2 X10.16
N$937: IC31.15(Q3) IC34.5(I5)
N$938: 19.6 IC34.13(O4) TP213.TP(PP)
N$939: 19.7 IC34.14(O3) TP214.TP(PP)
N$940: 20.6 JP17.2 TP223.TP(PP)
N$941: LED23.K(C) R204.1
N$942: LED19.A LED20.A LED21.A LED22.A LED24.A R247.1
N$943: Q22.1(B) R248.2
N$944: IC31.3(Q0) IC34.1(I1) IC34.2(I2) Q28.1(G)
N$945: IC31.14(Q1) IC34.6(I6)
N$946: 19.3 IC34.11(O6) TP210.TP(PP)
N$947: Q23.1(B) Q23.2(C) Q24.1(B) R199.1 R270.1 X12.2
N$948: Q24.3(E) R250.2
N$949: Q23.3(E) R249.2
N$950: IC35.7(B:+IN) R190.1 R251.1
N$951: IC40.2(A:-IN) R188.2
N$952: Q26.1(B) R252.2
N$953: Q27.3(D) R253.2
N$954: IC33.2(VO) R182.2
N$955: IC33.3(VI) Q25.2(C)
N$956: C37.2 D43.2(-) IC37.2(TR) IC37.6(THR) R256.1
N$957: IC37.5(CV) R257.2
N$958: IC37.3(Q) IC38.12(B:A) R257.1
N$959: D43.1(+) R258.1
N$960: 19.10 D35.2(-) D36.2(-) JP20.1 SJ4.1 TP217.TP(PP)
N$961: JP20.2 R259.2 R260.2 SJ4.2
N$962: IC38.9(B:!Q) IC38.11(B:B) R263.2
N$963: C39.1 IC38.14(B:T2) R261.1
N$964: JP16.1 R262.2
N$965: IC34.15(O2) R248.1
N$966: 20.12 R263.1 TP230.TP(PP)
N$967: D40.1(+) JP18.2
N$968: D34.2(-) IC35.2(A:OUT) JP17.1 Q27.1(G) R255.2
N$969: IC40.1(A:OUT) R264.2
N$970: C40.1 R264.1 R265.1
N$971: IC40.5(B:+IN) R265.2 R266.2
N$972: IC40.6(B:-IN) R267.1 R268.2
N$973: D41.1(+) JP19.1
N$974: JP17.3 R253.1 R254.1
N$975: IC35.13(D:OUT)
N$976: R200.1 X10.21
N$977: Q26.2(C) R200.2 R269.1
VCC: 6V4.TP(PP) C33.1 IC32.OUT IC35.3(P:V+) IC36.1(OUT) IC40.8(P:V+) R190.2 R193.2 R196.1 R247.2 R267.2 ; also sheet 1,2,3,4,5,6,7,8,9,11,12
Unconnected: IC31.4(Q7) IC31.5(Q9) IC31.7(Q6) IC31.9(Q8) IC37.7(DIS) IC38.2(A:T2) IC38.6(A:Q) IC38.7(A:!Q) IC38.10(B:Q) X10.20 X10.24

### Notes on the sheet
- Externe Beschaltung
- Variante "eine LED leuchtet"
- Variante "alle LEDs bis und
   mit Gang X leuchten"
- Anzeige:
- Klemmleisten
  Ausgang:
- Gang 1
- DauerPlus
  Konstant-Strom für LEDs
  Gang 1
  Gang 2
  Gang 3
  Gang 4
  Gang 5
  Neutrallampe
  Blinker rechts
  Blinker zusammen
  Blinker links
  Masse
- Gang 1
- Gang 2
- Gang 2
- Gang 3
- Gang 3
- Gang 1 | Gang 2 | Gang 3 | Gang 4 | Gang 5
- Gang 4
- Gang 4 | Klemmleisten Ausgang:
- Gang 5
- Gang 5
- Zündugsplus
  Choke
  Öldrucklampe
  Temperaturlampe
  Ladekontrolllampe
  Tankgeber (100hm)
  ABS-Lampe
  Lampentest
  Warnlampe
  Fernlichtlampe
  Geschwindigkeitssignal
  Menütaster
- Stromquelle für Gang
  LEDs. Für mehr als 12mA
  muss ein Widerstand "R_user"
  eingelötet werden. Für weniger
  muss der 1kOhm SMD Widerstand
  neben R_user entfernt werden
  I = 12V/1kOhm(default)+12V/R_user
  I= 12mA (default) + 12V/R_user
  Beispiel:
  R_user      Strom in LEDs
  1 kOhm     22-26mA
  ohne       11-13mA
- Externe Beschaltung
- an Zündungsplus anhängen
  (Neutral leuchtet wenn Gang 0
  eingelegt und Zündschlüssel steckt )
- Neutrallampe
  für eigene
  Ganganzeige
- DauerPlus Batterie 12V (rot weiss)
  Ganganzeige Signal C (gelb weiss)
  Ganganzeige Signal B (gelb schwarz)
  Ganganzeige Signal A (gelb dunkelblau)
  12V/350mA zum Starknopf (schwarz grün)
  Zündungsplus 12V (grün schwarz)
  Reservelampe (weiss)
  ABS Leuchte (blau)
  Ladekontrollleuchte (schaltet auf Masse) (violett schwarz)
  Temperaturleuchte (schaltet auf Masse) (braun schwarz)
  Öldruckleuchte (schaltet auf Masse) (braun grün)
  Chokelampe (schaltet auf Masse) (violett weiss)
- BL resistors
- 1k
- an Ausgang "Neutrallampe" anhängen
- Masse (braun)
  Lampentest (schaltet auf Masse)(weiss blau)
  Fernlichtlampe (12V) (weiss)
  Drehzahl Zündspule (schwarz blau)
  Blinker rechts (blau scharz)
  Masse (braun)
  Blinker links (blau rot)
  nicht angeschlossen
  Tachosiganl zum Blinrelais (balu grün)
  Tachogeber (gelb)
  Masse Tachobeger (braun)
  Tachobeleuchtung (12V Zündungsplus) (grau blau)
- RES | BAR
- 4.7V | rising edge trigger A
- ZündungsPlus
- current source 96mA
- 6V regulated for Opamps
- nicht bestückt

## Sheet 11 of 12
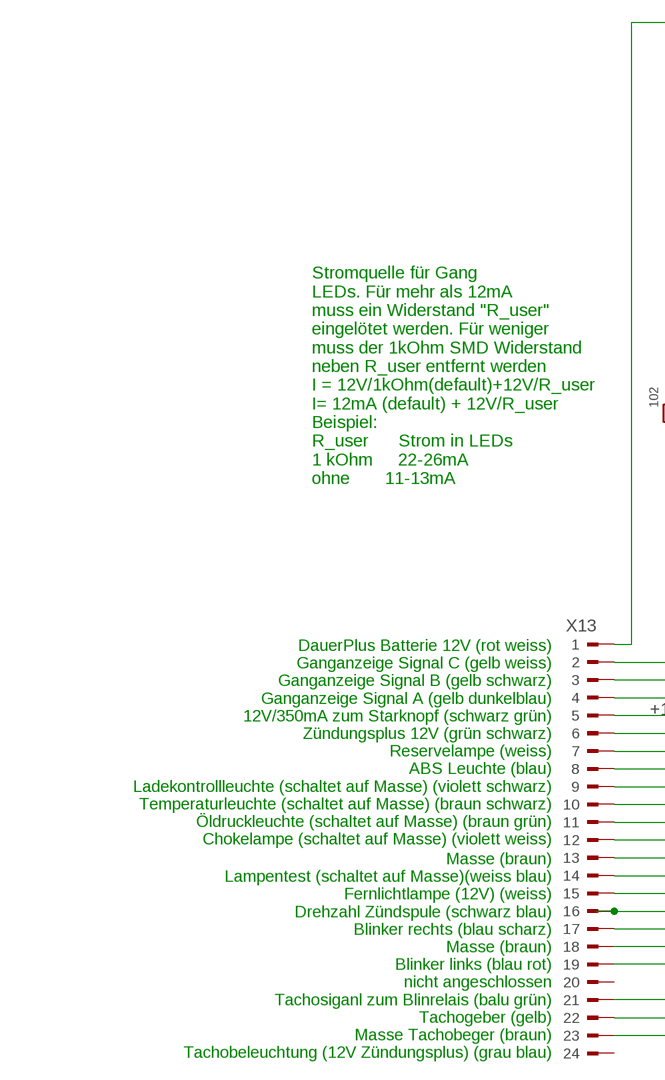
[diagram p20: schematic, sheet 11, part 1 of 2]
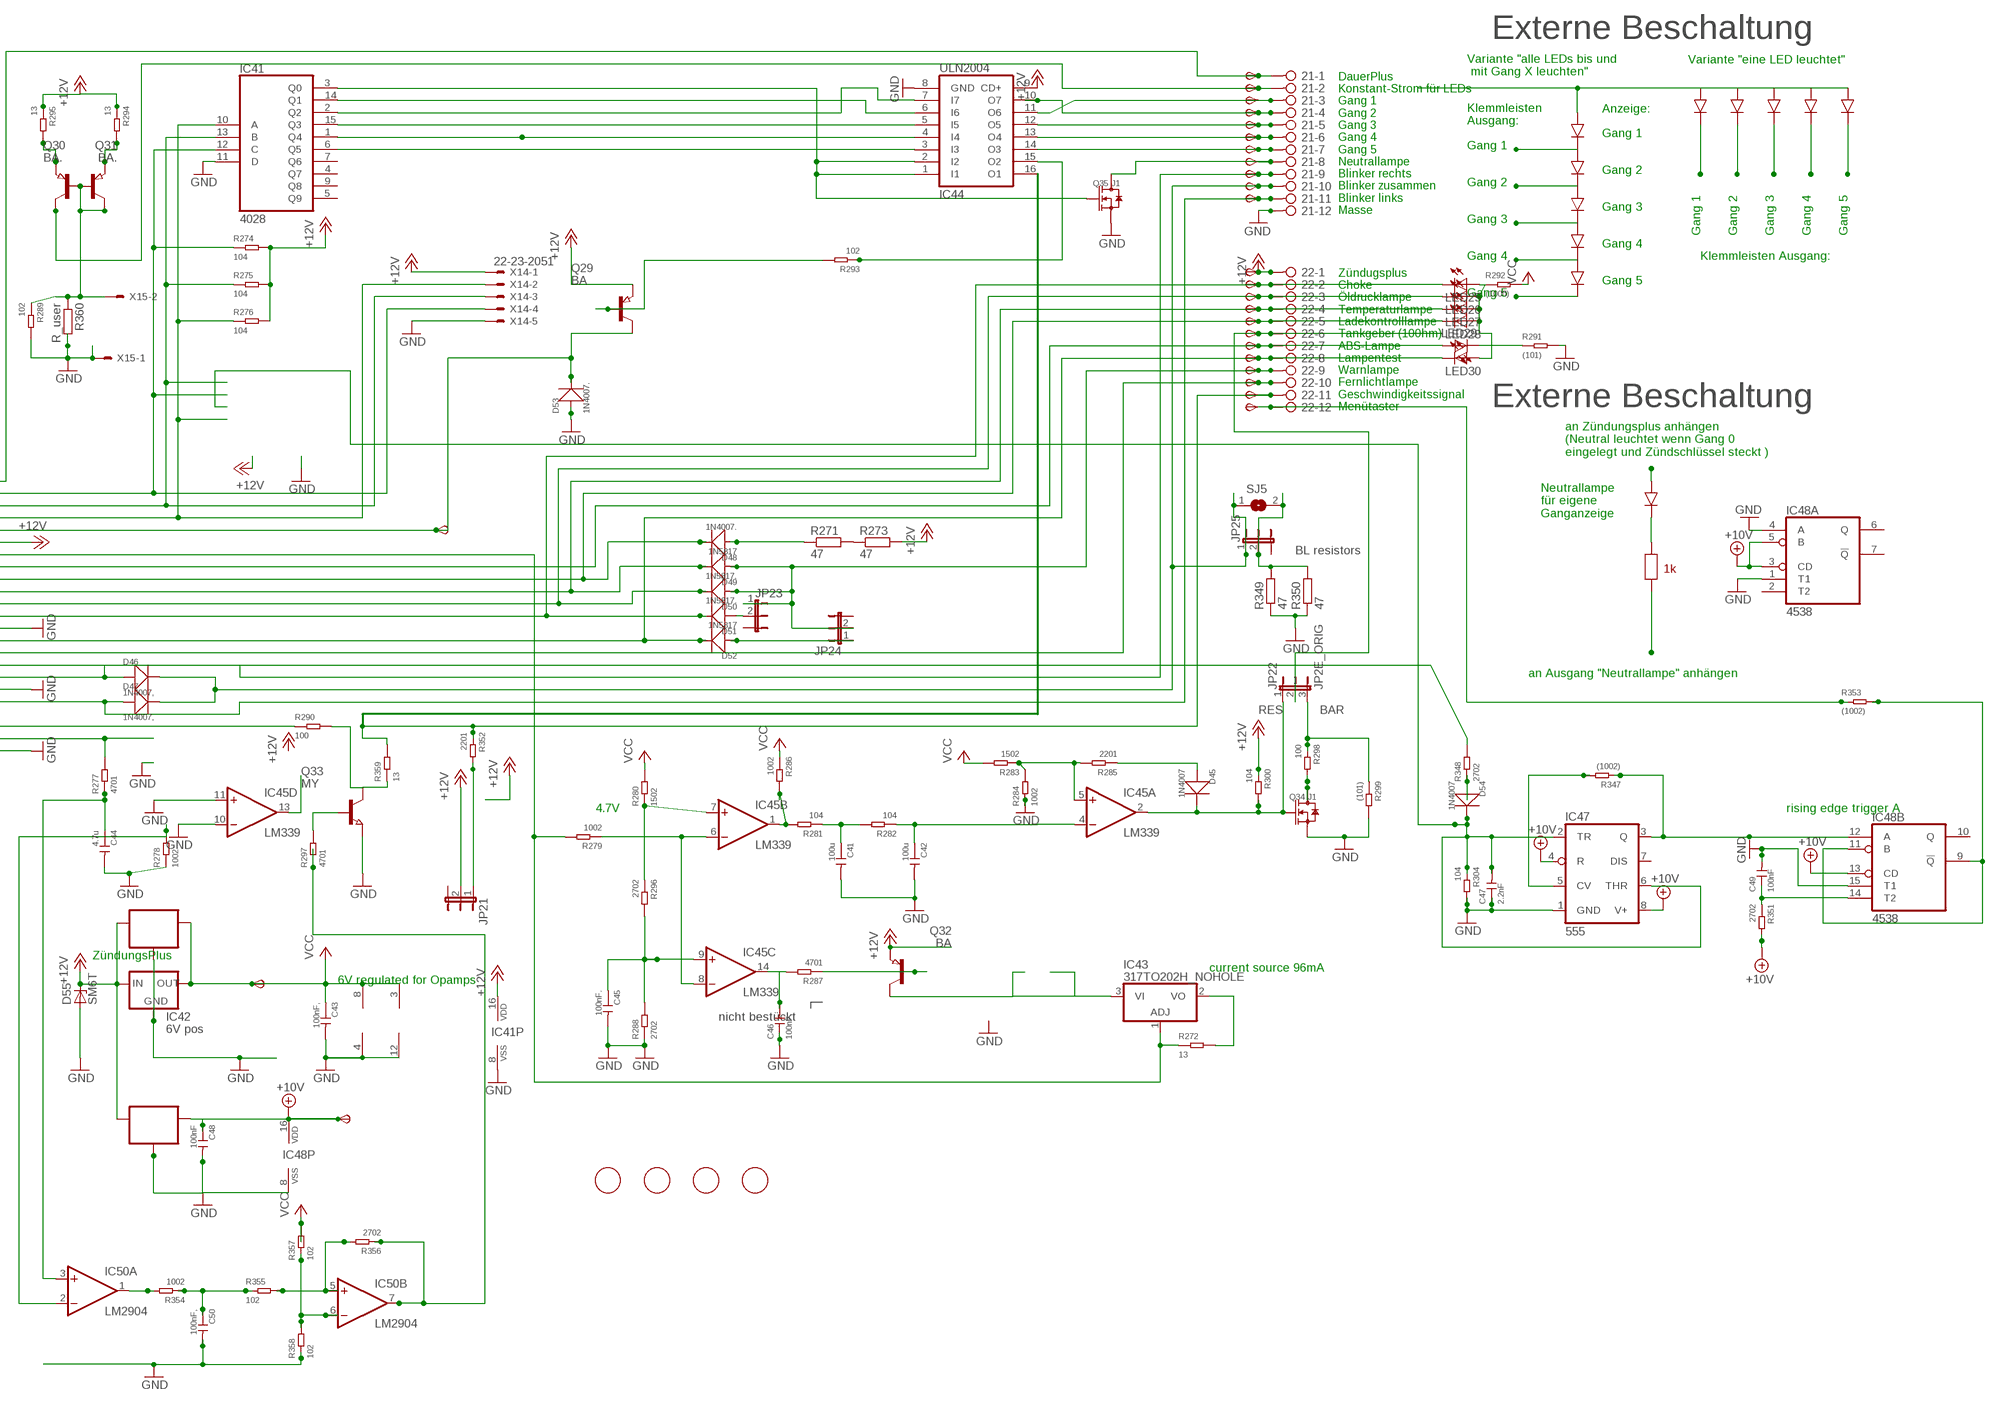
[diagram p21: schematic, sheet 11, part 2 of 2]

### Parts
6V5  TPSB2.0  [B2.0]
10V5  TPSB2.0  [B2.0]
21  2081-1132  [12-PIN]
22  2081-1132  [12-PIN]
C41  100u  CERAMIC-100UF-6.3V-20%-X5R(1206)  [C1206]
C42  100u  CERAMIC-100UF-6.3V-20%-X5R(1206)  [C1206]
C43  100nF,  CERAMIC-100NF-50V-10%-X7R(0805)  [C0805]
C44  4.7u  CERAMIC-4.7UF-25V-10%-X5R(0805)  [C0805]
C45  100nF.  CERAMIC-100NF-50V-10%-X7R(0805)  [C0805]
C46  100nF.  CERAMIC-100NF-50V-10%-X7R(0805)  [C0805]
C47  2.2nF  CERAMIC-100NF-50V-10%-X7R(0805)  [C0805]
C48  100nF  CERAMIC-100NF-50V-10%-X7R(0805)  [C0805]
C49  100nF  CERAMIC-100NF-50V-10%-X7R(0805)  [C0805]
C50  100nF,  CERAMIC-100NF-50V-10%-X7R(0805)  [C0805]
D45  1N4007  DIODE-GEN-PURPOSE-1KV-1A(DO-214AC)  [DO-214AC]
D46  1N4007,  DIODE-GEN-PURPOSE-1KV-1A(DO-214AC)  [DO-214AC]
D47  1N4007,  DIODE-GEN-PURPOSE-1KV-1A(DO-214AC)  [DO-214AC]
D48  1N4007.  DIODE-GEN-PURPOSE-1KV-1A(DO-214AC)  [DO-214AC]
D49  1N5817  DIODE-GEN-PURPOSE-1KV-1A(DO-214AC)DO-214AC/1206  [DO-214AC_SLIM]
D50  1N5817.  DIODE-GEN-PURPOSE-1KV-1A(DO-214AC)DO-214AC/1206  [DO-214AC_SLIM]
D51  1N5817.  DIODE-GEN-PURPOSE-1KV-1A(DO-214AC)DO-214AC/1206  [DO-214AC_SLIM]
D52  1N5817  DIODE-GEN-PURPOSE-1KV-1A(DO-214AC)DO-214AC/1206  [DO-214AC_SLIM]
D53  1N4007.  DIODE-GEN-PURPOSE-1KV-1A(DO-214AC)  [DO-214AC]
D54  1N4007  DIODE-GEN-PURPOSE-1KV-1A(DO-214AC)  [DO-214AC]
D55  SM6T  [DO214AA]
FID19  FIDUCIAL  [FIDUCIAL_1MM]
FID20  FIDUCIAL  [FIDUCIAL_1MM]
FID21  FIDUCIAL  [FIDUCIAL_1MM]
FID22  FIDUCIAL  [FIDUCIAL_1MM]
IC41  4028  4028D  [SO16]
IC42  6V pos  78LXX  [78LXX]
IC43  317TO202H_NOHOLE  [TO220H_NOHOLE]
IC44  ULN2004  ULN2004AD  [SO16]
IC45  LM339  LM339D  [SO14]
IC46  78L06  78LXXSOT89_ROUND  [SOT89_ROUND]
IC47  555  NE555D  [SO08]
IC48  4538  4538D  [SO16]
IC49  78L10  78LXXSOT89_ROUND  [SOT89_ROUND]
IC50  LM2904  LM358D  [SO08]
JP21  JP2EJP2_SMALLPADS  [JP2_SMALLPADS]
JP22  JP2E_ORIG  [JP2_ORIG_SMALLPADS]
JP23  JP2EJP2_SMALLPADS  [JP2_SMALLPADS]
JP24  JP2EJP2_SMALLPADS  [JP2_SMALLPADS]
JP25  JP2EJP2_SMALLPADS  [JP2_SMALLPADS]
LED25  LEDLD260  [LD260]
LED26  LEDLD260  [LD260]
LED27  LEDLD260  [LD260]
LED28  LEDLD260  [LD260]
LED29  LEDLD260  [LD260]
LED30  LEDLD260  [LD260]
Q29  BA  PNP-TRANSISTOR_SOT89  [SOT89]
Q30  BA.  PNP-TRANSISTOR_SOT89  [SOT89]
Q31  BA.  PNP-TRANSISTOR_SOT89  [SOT89]
Q32  BA  PNP-TRANSISTOR_SOT89  [SOT89]
Q33  MY  NPN-TRANSISTOR_SOT89  [SOT89]
Q34  J1  SMD-MOSFET-N-CH-50V-200MA-BSS138W-7-F(SOT-23)  [SOT-23]
Q35  J1  SMD-MOSFET-N-CH-50V-200MA-BSS138W-7-F(SOT-23)  [SOT-23]
R271  47  R-EU_V235/17_1MM  [V235/17_1MM]
R272  13  SMD-RES-13R-5%-1/4W(1206)  [R1206]
R273  47  R-EU_V235/17_1MM  [V235/17_1MM]
R274  104  SMD-RES-10K-1%-1/8W(0805)  [R0805]
R275  104  SMD-RES-10K-1%-1/8W(0805)  [R0805]
R276  104  SMD-RES-10K-1%-1/8W(0805)  [R0805]
R277  4701  SMD-RES-4.7K-5%-1/8W(0805)  [R0805]
R278  1002  SMD-RES-10K-1%-1/8W(0805)  [R0805]
R279  1002  SMD-RES-10K-1%-1/8W(0805)  [R0805]
R280  1502  SMD-RES-10K-1%-1/8W(0805)  [R0805]
R281  104  SMD-RES-10K-1%-1/8W(0805)  [R0805]
R282  104  SMD-RES-10K-1%-1/8W(0805)  [R0805]
R283  1502  SMD-RES-10K-1%-1/8W(0805)  [R0805]
R284  1002  SMD-RES-10K-1%-1/8W(0805)  [R0805]
R285  2201  SMD-RES-2.2K-5%-1/8W(0805)  [R0805]
R286  1002  SMD-RES-10K-1%-1/8W(0805)  [R0805]
R287  4701  SMD-RES-4.7K-5%-1/8W(0805)  [R0805]
R288  2702  SMD-RES-4.7K-5%-1/8W(0805)  [R0805]
R289  102  SMD-RES-1K-5%-1/8W(0805)  [R0805]
R290  100  SMD-RES-220R-5%-1/8W(0805)  [R0805]
R291  (101)  SMD-RES-100R-5%-1/8W(0805)  [R0805]
R292  (1000)  SMD-RES-100R-5%-1/8W(0805)  [R0805]
R293  102  SMD-RES-1K-5%-1/8W(0805)  [R0805]
R294  13  SMD-RES-13R-5%-1/4W(1206)  [R1206]
R295  13  SMD-RES-13R-5%-1/4W(1206)  [R1206]
R296  2702  SMD-RES-4.7K-5%-1/8W(0805)  [R0805]
R297  4701  SMD-RES-4.7K-5%-1/8W(0805)  [R0805]
R298  100  SMD-RES-2.2K-5%-1/8W(0805)  [R0805]
R299  (101)  SMD-RES-2.2K-5%-1/8W(0805)  [R0805]
R300  104  SMD-RES-10K-1%-1/8W(0805)  [R0805]
R304  104  SMD-RES-10K-1%-1/8W(0805)  [R0805]
R347  (1002)  SMD-RES-10K-1%-1/8W(0805)  [R0805]
R348  2702  SMD-RES-10K-1%-1/8W(0805)  [R0805]
R349  47  R-EU_V235/17_1MM  [V235/17_1MM]
R350  47  R-EU_V235/17_1MM  [V235/17_1MM]
R351  2702  SMD-RES-4.7K-5%-1/8W(0805)  [R0805]
R352  2201  SMD-RES-2.2K-5%-1/8W(0805)  [R0805]
R353  (1002)  SMD-RES-4.7K-5%-1/8W(0805)  [R0805]
R354  1002  SMD-RES-10K-1%-1/8W(0805)  [R0805]
R355  102  SMD-RES-1K-5%-1/8W(0805)  [R0805]
R356  2702  SMD-RES-4.7K-5%-1/8W(0805)  [R0805]
R357  102  SMD-RES-1K-5%-1/8W(0805)  [R0805]
R358  102  SMD-RES-1K-5%-1/8W(0805)  [R0805]
R359  13  SMD-RES-13R-5%-1/4W(1206)  [R1206]
R360  R_user  R-EU_R0805  [R0805]
SJ5  SJ  [SJ]
START5  TPSB2.0  [B2.0]
TP231  TPSB2.0  [B2.0]
TP232  TPSB2.0  [B2.0]
TP233  TPSB2.0  [B2.0]
TP234  TPSB2.0  [B2.0]
TP235  TPSB2.0  [B2.0]
TP236  TPSB2.0  [B2.0]
TP237  TPSB2.0  [B2.0]
TP238  TPSB2.0  [B2.0]
TP239  TPSB2.0  [B2.0]
TP240  TPSB2.0  [B2.0]
TP241  TPSB2.0  [B2.0]
TP242  TPSB2.0  [B2.0]
TP243  TPSB2.0  [B2.0]
TP244  TPSB2.0  [B2.0]
TP245  TPSB2.0  [B2.0]
TP246  TPSB2.0  [B2.0]
TP247  TPSB2.0  [B2.0]
TP248  TPSB2.0  [B2.0]
TP249  TPSB1,27  [B1,27]
TP250  TPSB2.0  [B2.0]
TP251  TPSB2.0  [B2.0]
TP252  TPSB2.0  [B2.0]
TP253  TPSB2.0  [B2.0]
X13  CON_BMWV2  [24-PIN_V2]
X14  22-23-2051  [22-23-2051]
X15  22-23-2021  [22-23-2021]

### Nets
+10V: 10V5.TP(PP) C48.1 IC47.4(R) IC47.8(V+) IC48.3(A:CD) IC48.5(A:B) IC48.13(B:CD) IC48.16(P:VDD) IC49.1(OUT) R351.2 ; also sheet 1,2,3,4,5,6,7,8,9,10,12
+12V: 22.1 D55.C IC41.16(VDD) IC42.IN IC44.9(CD+) IC46.3(IN) IC49.3(IN) JP21.2 Q29.3(E) Q32.3(E) R273.2 R274.2 R275.2 R276.2 R294.1 R295.1 R300.1 TP252.TP(PP) X13.6 X14.1 ; also sheet 1,2,3,4,5,6,7,8,9,10,12
+12V11: IC50.7(B:OUT) R297.1 R356.1
GND: 21.12 C41.2 C42.2 C43.2 C44.2 C45.2 C46.1 C47.1 C48.2 C49.2 C50.2 D53.1(+) D55.A IC41.8(VSS) IC41.11(D) IC42.GND IC44.8(GND) IC45.10(D:-IN) IC45.11(D:+IN) IC45.12(P:GND) IC46.2(GND) IC46.2@1(GND) IC47.1(GND) IC48.1(A:T1) IC48.4(A:A) IC48.8(P:VSS) IC48.15(B:T1) IC49.2(GND) IC49.2@1(GND) IC50.4(P:V-) Q33.3(E) Q34.2(S) Q35.2(S) R278.1 R284.1 R288.1 R289.2 R291.2 R299.2 R304.2 R349.1 R350.1 R358.1 R360.2 X13.13 X13.18 X13.23 X14.5 X15.1 ; also sheet 1,2,3,4,5,6,7,8,9,10,12
N$978: R271.2 R273.1
N$979: 22.9 D49.1(+) D50.1(+) JP23.1 JP24.2 TP249.TP(PP)
N$980: IC41.10(A) R276.1 X13.4 X14.2
N$981: IC41.13(B) R275.1 X13.3 X14.3
N$982: D53.2(-) Q29.2(C) START5.TP(PP) X13.5
N$983: IC41.12(C) R274.1 X13.2 X14.4
N$984: 22.7 LED29.A TP247.TP(PP) X13.8
N$985: 22.2 D51.2(-) LED25.K(C) TP242.TP(PP) X13.12
N$986: 22.3 D50.2(-) LED26.K(C) TP243.TP(PP) X13.11
N$987: 22.4 D49.2(-) LED27.K(C) TP244.TP(PP) X13.10
N$988: 22.8 D52.2(-) LED30.K(C) TP248.TP(PP) X13.14
N$989: 21.9 D46.1(+) TP239.TP(PP) X13.17
N$990: 21.11 D47.1(+) TP241.TP(PP) X13.19
N$991: R277.2 X13.22
N$992: C44.1 IC50.3(A:+IN) R277.1
N$993: 22.11 IC44.16(O1) R352.1 R359.2 TP251.TP(PP)
N$994: IC45.1(B:OUT) R281.2 R286.2
N$995: C41.1 R281.1 R282.2
N$996: C42.1 IC45.4(A:-IN) R282.1
N$997: IC45.5(A:+IN) R283.1 R284.2 R285.2
N$998: D45.1(+) R285.1
N$999: C45.1 IC45.9(C:+IN) R288.2 R296.2
N$1000: C46.2 IC45.14(C:OUT) R287.2
N$1001: Q32.1(B) R287.1
N$1002: IC41.2(Q2) IC44.7(I7)
N$1003: 21.5 IC44.12(O5) TP235.TP(PP)
N$1004: IC41.1(Q4) IC44.4(I4)
N$1005: 21.8 Q35.3(D) TP238.TP(PP)
N$1006: 22.10 TP250.TP(PP) X13.15
N$1007: 22.5 D48.2(-) LED28.K(C) TP245.TP(PP) X13.9
N$1008: D48.1(+) R271.1
N$1009: IC41.6(Q5) IC44.3(I3)
N$1010: 21.4 IC44.10(O7) TP234.TP(PP)
N$1011: IC43.1(ADJ) R272.1 R279.2 X13.7
N$1012: IC45.6(B:-IN) IC45.8(C:-IN) R279.1
N$1013: 21.2 Q31.2(C) TP232.TP(PP)
N$1014: 21.1 TP231.TP(PP) X13.1
N$1028: R348.2 X13.16
N$1029: IC41.15(Q3) IC44.5(I5)
N$1030: 21.6 IC44.13(O4) TP236.TP(PP)
N$1031: 21.7 IC44.14(O3) TP237.TP(PP)
N$1032: 22.6 JP22.2 TP246.TP(PP)
N$1033: LED29.K(C) R291.1
N$1034: LED25.A LED26.A LED27.A LED28.A LED30.A R292.1
N$1035: Q29.1(B) R293.2
N$1036: IC41.3(Q0) IC44.1(I1) IC44.2(I2) Q35.1(G)
N$1037: IC41.14(Q1) IC44.6(I6)
N$1038: 21.3 IC44.11(O6) TP233.TP(PP)
N$1039: Q30.1(B) Q30.2(C) Q31.1(B) R289.1 R360.1 X15.2
N$1040: Q31.3(E) R295.2
N$1041: Q30.3(E) R294.2
N$1042: IC45.7(B:+IN) R280.1 R296.1
N$1043: IC50.2(A:-IN) R278.2
N$1044: Q33.1(B) R297.2
N$1045: Q34.3(D) R298.2
N$1046: IC43.2(VO) R272.2
N$1047: IC43.3(VI) Q32.2(C)
N$1048: C47.2 D54.2(-) IC47.2(TR) IC47.6(THR) R304.1
N$1049: IC47.5(CV) R347.2
N$1050: IC47.3(Q) IC48.12(B:A) R347.1
N$1051: D54.1(+) R348.1
N$1052: 21.10 D46.2(-) D47.2(-) JP25.1 SJ5.1 TP240.TP(PP)
N$1053: JP25.2 R349.2 R350.2 SJ5.2
N$1054: IC48.9(B:!Q) IC48.11(B:B) R353.2
N$1055: C49.1 IC48.14(B:T2) R351.1
N$1056: JP21.1 R352.2
N$1057: IC44.15(O2) R293.1
N$1058: 22.12 R353.1 TP253.TP(PP)
N$1059: D51.1(+) JP23.2
N$1060: D45.2(-) IC45.2(A:OUT) JP22.1 Q34.1(G) R300.2
N$1061: IC50.1(A:OUT) R354.2
N$1062: C50.1 R354.1 R355.1
N$1063: IC50.5(B:+IN) R355.2 R356.2
N$1064: IC50.6(B:-IN) R357.1 R358.2
N$1065: D52.1(+) JP24.1
N$1066: JP22.3 R298.1 R299.1
N$1067: IC45.13(D:OUT)
N$1068: R290.1 X13.21
N$1069: Q33.2(C) R290.2 R359.1
VCC: 6V5.TP(PP) C43.1 IC42.OUT IC45.3(P:V+) IC46.1(OUT) IC50.8(P:V+) R280.2 R283.2 R286.1 R292.2 R357.2 ; also sheet 1,2,3,4,5,6,7,8,9,10,12
Unconnected: IC41.4(Q7) IC41.5(Q9) IC41.7(Q6) IC41.9(Q8) IC47.7(DIS) IC48.2(A:T2) IC48.6(A:Q) IC48.7(A:!Q) IC48.10(B:Q) X13.20 X13.24

### Notes on the sheet
- Externe Beschaltung
- Variante "eine LED leuchtet"
- Variante "alle LEDs bis und
   mit Gang X leuchten"
- Anzeige:
- Klemmleisten
  Ausgang:
- Gang 1
- DauerPlus
  Konstant-Strom für LEDs
  Gang 1
  Gang 2
  Gang 3
  Gang 4
  Gang 5
  Neutrallampe
  Blinker rechts
  Blinker zusammen
  Blinker links
  Masse
- Gang 1
- Gang 2
- Gang 2
- Gang 3
- Gang 3
- Gang 1 | Gang 2 | Gang 3 | Gang 4 | Gang 5
- Gang 4
- Gang 4 | Klemmleisten Ausgang:
- Gang 5
- Gang 5
- Zündugsplus
  Choke
  Öldrucklampe
  Temperaturlampe
  Ladekontrolllampe
  Tankgeber (100hm)
  ABS-Lampe
  Lampentest
  Warnlampe
  Fernlichtlampe
  Geschwindigkeitssignal
  Menütaster
- Stromquelle für Gang
  LEDs. Für mehr als 12mA
  muss ein Widerstand "R_user"
  eingelötet werden. Für weniger
  muss der 1kOhm SMD Widerstand
  neben R_user entfernt werden
  I = 12V/1kOhm(default)+12V/R_user
  I= 12mA (default) + 12V/R_user
  Beispiel:
  R_user      Strom in LEDs
  1 kOhm     22-26mA
  ohne       11-13mA
- Externe Beschaltung
- an Zündungsplus anhängen
  (Neutral leuchtet wenn Gang 0
  eingelegt und Zündschlüssel steckt )
- Neutrallampe
  für eigene
  Ganganzeige
- DauerPlus Batterie 12V (rot weiss)
  Ganganzeige Signal C (gelb weiss)
  Ganganzeige Signal B (gelb schwarz)
  Ganganzeige Signal A (gelb dunkelblau)
  12V/350mA zum Starknopf (schwarz grün)
  Zündungsplus 12V (grün schwarz)
  Reservelampe (weiss)
  ABS Leuchte (blau)
  Ladekontrollleuchte (schaltet auf Masse) (violett schwarz)
  Temperaturleuchte (schaltet auf Masse) (braun schwarz)
  Öldruckleuchte (schaltet auf Masse) (braun grün)
  Chokelampe (schaltet auf Masse) (violett weiss)
- BL resistors
- 1k
- an Ausgang "Neutrallampe" anhängen
- Masse (braun)
  Lampentest (schaltet auf Masse)(weiss blau)
  Fernlichtlampe (12V) (weiss)
  Drehzahl Zündspule (schwarz blau)
  Blinker rechts (blau scharz)
  Masse (braun)
  Blinker links (blau rot)
  nicht angeschlossen
  Tachosiganl zum Blinrelais (balu grün)
  Tachogeber (gelb)
  Masse Tachobeger (braun)
  Tachobeleuchtung (12V Zündungsplus) (grau blau)
- RES | BAR
- 4.7V | rising edge trigger A
- ZündungsPlus
- current source 96mA
- 6V regulated for Opamps
- nicht bestückt

## Sheet 12 of 12
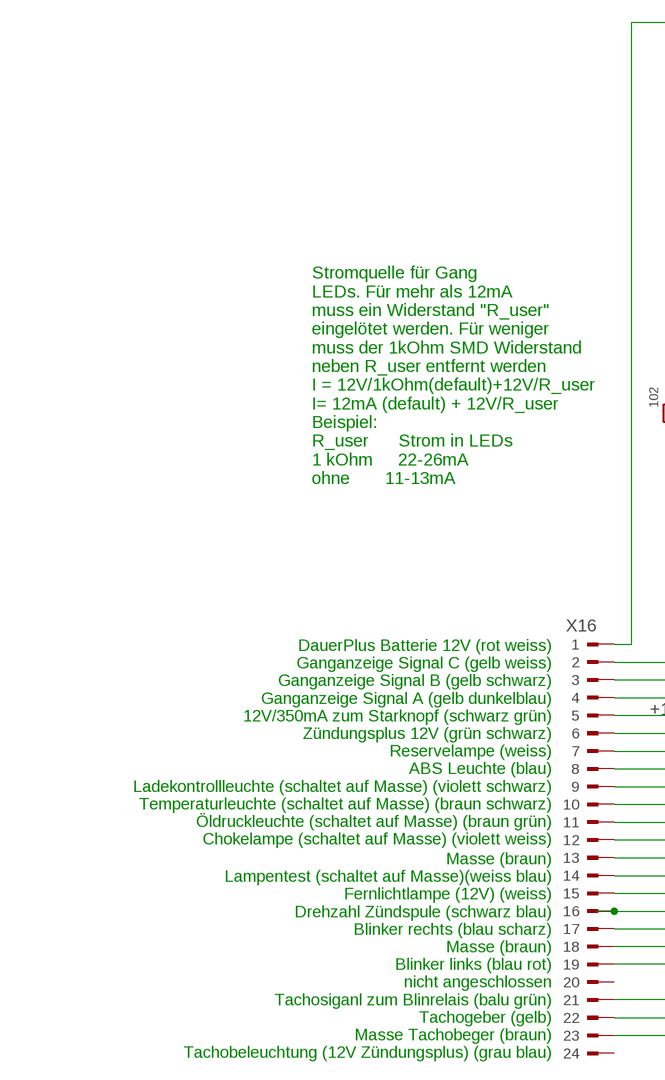
[diagram p22: schematic, sheet 12, part 1 of 2]
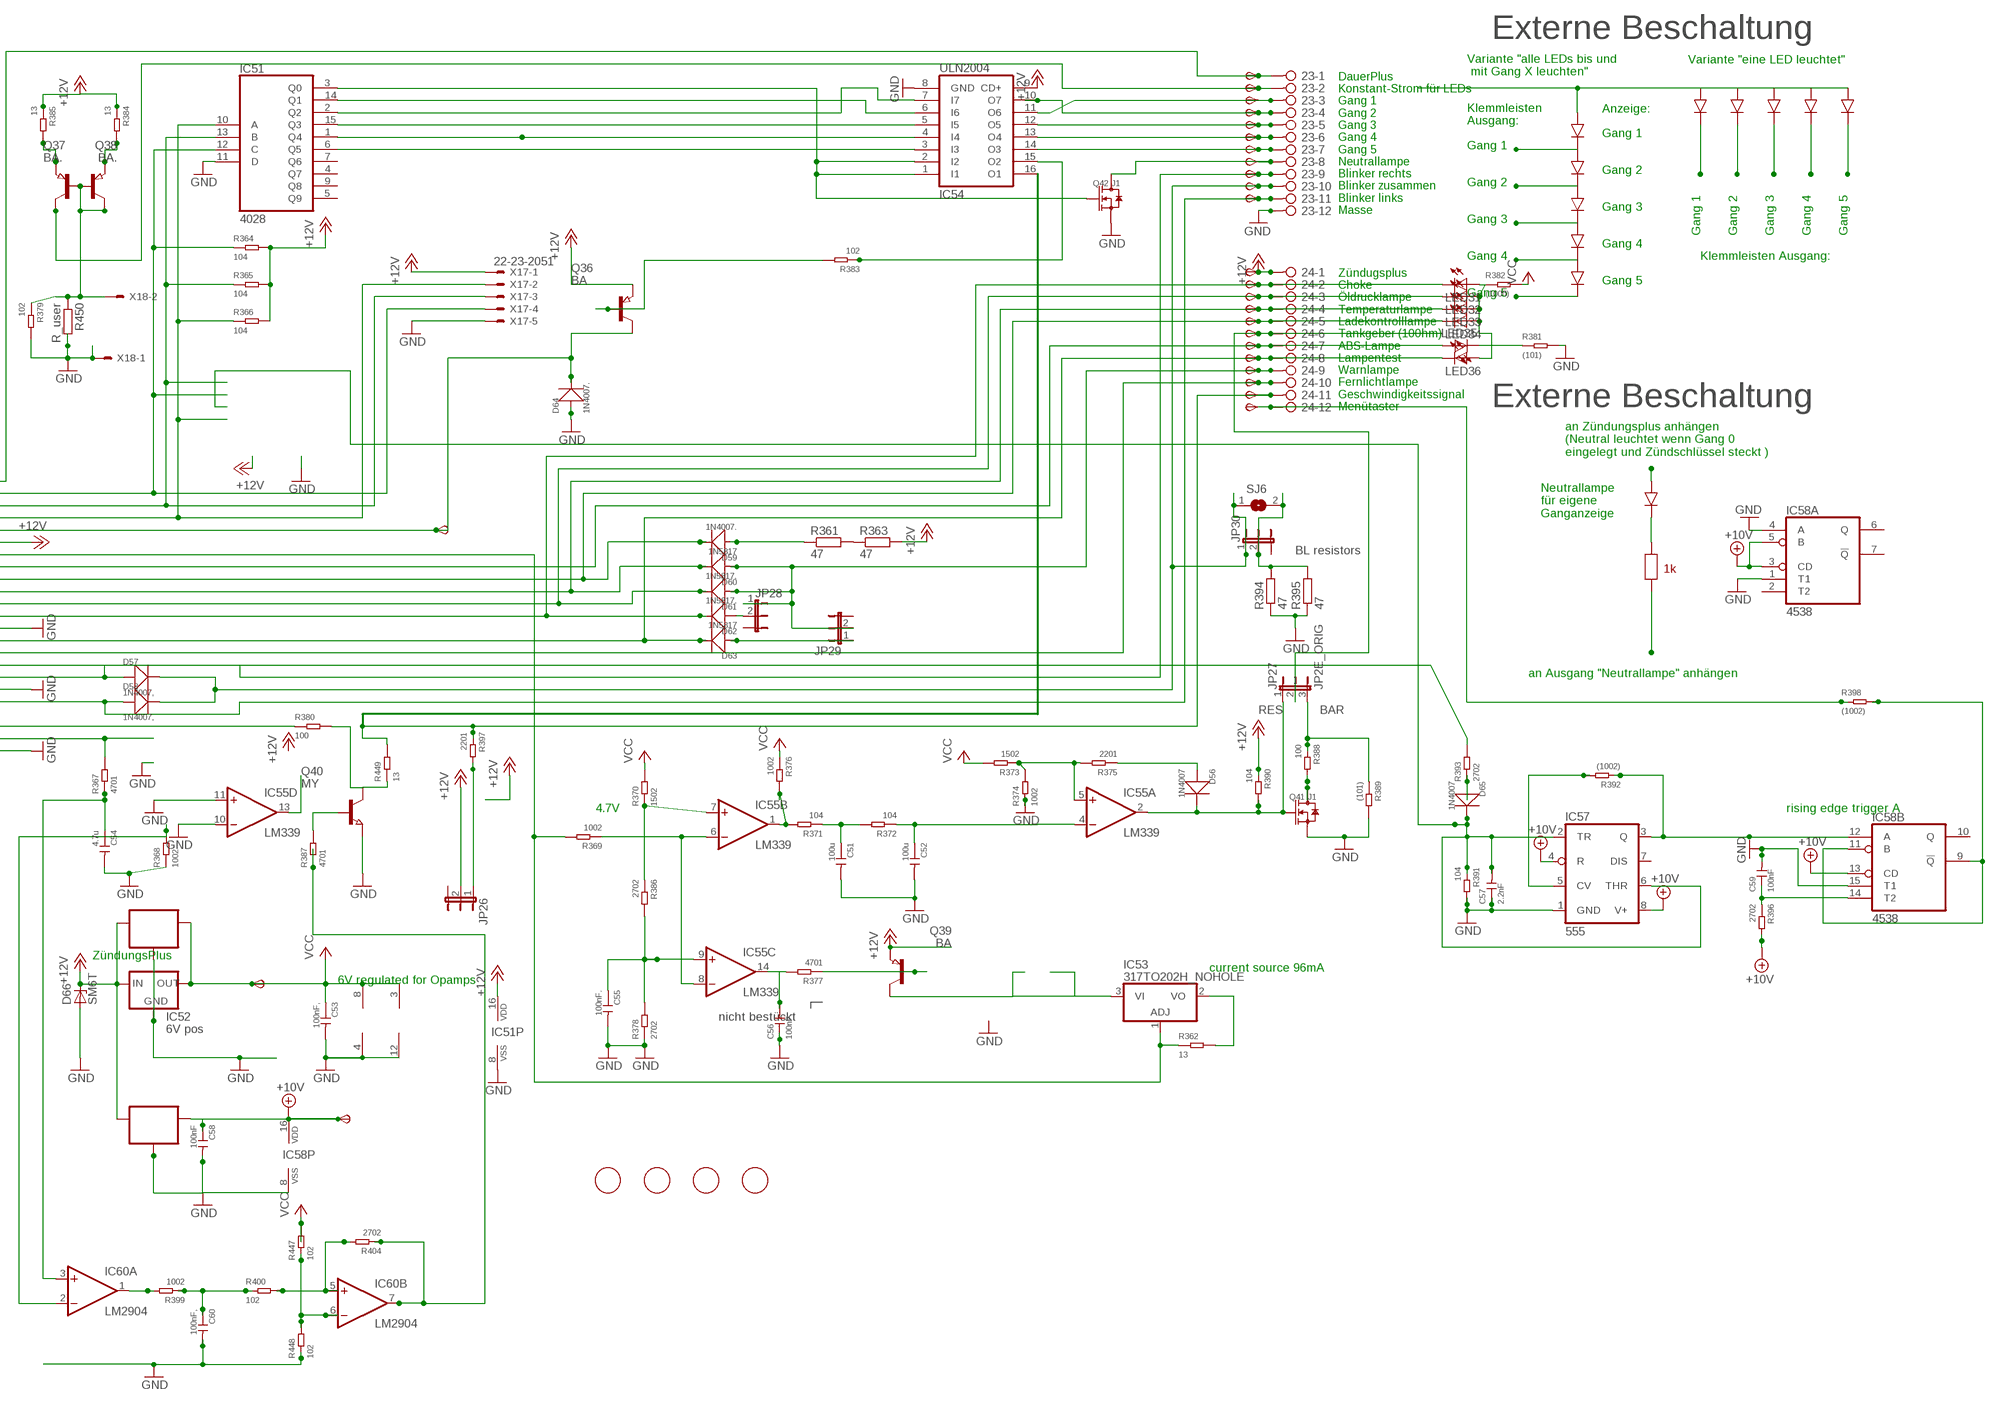
[diagram p23: schematic, sheet 12, part 2 of 2]

### Parts
6V6  TPSB2.0  [B2.0]
10V6  TPSB2.0  [B2.0]
23  2081-1132  [12-PIN]
24  2081-1132  [12-PIN]
C51  100u  CERAMIC-100UF-6.3V-20%-X5R(1206)  [C1206]
C52  100u  CERAMIC-100UF-6.3V-20%-X5R(1206)  [C1206]
C53  100nF,  CERAMIC-100NF-50V-10%-X7R(0805)  [C0805]
C54  4.7u  CERAMIC-4.7UF-25V-10%-X5R(0805)  [C0805]
C55  100nF.  CERAMIC-100NF-50V-10%-X7R(0805)  [C0805]
C56  100nF.  CERAMIC-100NF-50V-10%-X7R(0805)  [C0805]
C57  2.2nF  CERAMIC-100NF-50V-10%-X7R(0805)  [C0805]
C58  100nF  CERAMIC-100NF-50V-10%-X7R(0805)  [C0805]
C59  100nF  CERAMIC-100NF-50V-10%-X7R(0805)  [C0805]
C60  100nF,  CERAMIC-100NF-50V-10%-X7R(0805)  [C0805]
D56  1N4007  DIODE-GEN-PURPOSE-1KV-1A(DO-214AC)  [DO-214AC]
D57  1N4007,  DIODE-GEN-PURPOSE-1KV-1A(DO-214AC)  [DO-214AC]
D58  1N4007,  DIODE-GEN-PURPOSE-1KV-1A(DO-214AC)  [DO-214AC]
D59  1N4007.  DIODE-GEN-PURPOSE-1KV-1A(DO-214AC)  [DO-214AC]
D60  1N5817  DIODE-GEN-PURPOSE-1KV-1A(DO-214AC)DO-214AC/1206  [DO-214AC_SLIM]
D61  1N5817.  DIODE-GEN-PURPOSE-1KV-1A(DO-214AC)DO-214AC/1206  [DO-214AC_SLIM]
D62  1N5817.  DIODE-GEN-PURPOSE-1KV-1A(DO-214AC)DO-214AC/1206  [DO-214AC_SLIM]
D63  1N5817  DIODE-GEN-PURPOSE-1KV-1A(DO-214AC)DO-214AC/1206  [DO-214AC_SLIM]
D64  1N4007.  DIODE-GEN-PURPOSE-1KV-1A(DO-214AC)  [DO-214AC]
D65  1N4007  DIODE-GEN-PURPOSE-1KV-1A(DO-214AC)  [DO-214AC]
D66  SM6T  [DO214AA]
FID23  FIDUCIAL  [FIDUCIAL_1MM]
FID24  FIDUCIAL  [FIDUCIAL_1MM]
FID25  FIDUCIAL  [FIDUCIAL_1MM]
FID26  FIDUCIAL  [FIDUCIAL_1MM]
IC51  4028  4028D  [SO16]
IC52  6V pos  78LXX  [78LXX]
IC53  317TO202H_NOHOLE  [TO220H_NOHOLE]
IC54  ULN2004  ULN2004AD  [SO16]
IC55  LM339  LM339D  [SO14]
IC56  78L06  78LXXSOT89_ROUND  [SOT89_ROUND]
IC57  555  NE555D  [SO08]
IC58  4538  4538D  [SO16]
IC59  78L10  78LXXSOT89_ROUND  [SOT89_ROUND]
IC60  LM2904  LM358D  [SO08]
JP26  JP2EJP2_SMALLPADS  [JP2_SMALLPADS]
JP27  JP2E_ORIG  [JP2_ORIG_SMALLPADS]
JP28  JP2EJP2_SMALLPADS  [JP2_SMALLPADS]
JP29  JP2EJP2_SMALLPADS  [JP2_SMALLPADS]
JP30  JP2EJP2_SMALLPADS  [JP2_SMALLPADS]
LED31  LEDLD260  [LD260]
LED32  LEDLD260  [LD260]
LED33  LEDLD260  [LD260]
LED34  LEDLD260  [LD260]
LED35  LEDLD260  [LD260]
LED36  LEDLD260  [LD260]
Q36  BA  PNP-TRANSISTOR_SOT89  [SOT89]
Q37  BA.  PNP-TRANSISTOR_SOT89  [SOT89]
Q38  BA.  PNP-TRANSISTOR_SOT89  [SOT89]
Q39  BA  PNP-TRANSISTOR_SOT89  [SOT89]
Q40  MY  NPN-TRANSISTOR_SOT89  [SOT89]
Q41  J1  SMD-MOSFET-N-CH-50V-200MA-BSS138W-7-F(SOT-23)  [SOT-23]
Q42  J1  SMD-MOSFET-N-CH-50V-200MA-BSS138W-7-F(SOT-23)  [SOT-23]
R361  47  R-EU_V235/17_1MM  [V235/17_1MM]
R362  13  SMD-RES-13R-5%-1/4W(1206)  [R1206]
R363  47  R-EU_V235/17_1MM  [V235/17_1MM]
R364  104  SMD-RES-10K-1%-1/8W(0805)  [R0805]
R365  104  SMD-RES-10K-1%-1/8W(0805)  [R0805]
R366  104  SMD-RES-10K-1%-1/8W(0805)  [R0805]
R367  4701  SMD-RES-4.7K-5%-1/8W(0805)  [R0805]
R368  1002  SMD-RES-10K-1%-1/8W(0805)  [R0805]
R369  1002  SMD-RES-10K-1%-1/8W(0805)  [R0805]
R370  1502  SMD-RES-10K-1%-1/8W(0805)  [R0805]
R371  104  SMD-RES-10K-1%-1/8W(0805)  [R0805]
R372  104  SMD-RES-10K-1%-1/8W(0805)  [R0805]
R373  1502  SMD-RES-10K-1%-1/8W(0805)  [R0805]
R374  1002  SMD-RES-10K-1%-1/8W(0805)  [R0805]
R375  2201  SMD-RES-2.2K-5%-1/8W(0805)  [R0805]
R376  1002  SMD-RES-10K-1%-1/8W(0805)  [R0805]
R377  4701  SMD-RES-4.7K-5%-1/8W(0805)  [R0805]
R378  2702  SMD-RES-4.7K-5%-1/8W(0805)  [R0805]
R379  102  SMD-RES-1K-5%-1/8W(0805)  [R0805]
R380  100  SMD-RES-220R-5%-1/8W(0805)  [R0805]
R381  (101)  SMD-RES-100R-5%-1/8W(0805)  [R0805]
R382  (1000)  SMD-RES-100R-5%-1/8W(0805)  [R0805]
R383  102  SMD-RES-1K-5%-1/8W(0805)  [R0805]
R384  13  SMD-RES-13R-5%-1/4W(1206)  [R1206]
R385  13  SMD-RES-13R-5%-1/4W(1206)  [R1206]
R386  2702  SMD-RES-4.7K-5%-1/8W(0805)  [R0805]
R387  4701  SMD-RES-4.7K-5%-1/8W(0805)  [R0805]
R388  100  SMD-RES-2.2K-5%-1/8W(0805)  [R0805]
R389  (101)  SMD-RES-2.2K-5%-1/8W(0805)  [R0805]
R390  104  SMD-RES-10K-1%-1/8W(0805)  [R0805]
R391  104  SMD-RES-10K-1%-1/8W(0805)  [R0805]
R392  (1002)  SMD-RES-10K-1%-1/8W(0805)  [R0805]
R393  2702  SMD-RES-10K-1%-1/8W(0805)  [R0805]
R394  47  R-EU_V235/17_1MM  [V235/17_1MM]
R395  47  R-EU_V235/17_1MM  [V235/17_1MM]
R396  2702  SMD-RES-4.7K-5%-1/8W(0805)  [R0805]
R397  2201  SMD-RES-2.2K-5%-1/8W(0805)  [R0805]
R398  (1002)  SMD-RES-4.7K-5%-1/8W(0805)  [R0805]
R399  1002  SMD-RES-10K-1%-1/8W(0805)  [R0805]
R400  102  SMD-RES-1K-5%-1/8W(0805)  [R0805]
R404  2702  SMD-RES-4.7K-5%-1/8W(0805)  [R0805]
R447  102  SMD-RES-1K-5%-1/8W(0805)  [R0805]
R448  102  SMD-RES-1K-5%-1/8W(0805)  [R0805]
R449  13  SMD-RES-13R-5%-1/4W(1206)  [R1206]
R450  R_user  R-EU_R0805  [R0805]
SJ6  SJ  [SJ]
START6  TPSB2.0  [B2.0]
TP254  TPSB2.0  [B2.0]
TP255  TPSB2.0  [B2.0]
TP256  TPSB2.0  [B2.0]
TP257  TPSB2.0  [B2.0]
TP258  TPSB2.0  [B2.0]
TP259  TPSB2.0  [B2.0]
TP260  TPSB2.0  [B2.0]
TP261  TPSB2.0  [B2.0]
TP262  TPSB2.0  [B2.0]
TP263  TPSB2.0  [B2.0]
TP264  TPSB2.0  [B2.0]
TP265  TPSB2.0  [B2.0]
TP266  TPSB2.0  [B2.0]
TP267  TPSB2.0  [B2.0]
TP268  TPSB2.0  [B2.0]
TP269  TPSB2.0  [B2.0]
TP270  TPSB2.0  [B2.0]
TP271  TPSB2.0  [B2.0]
TP272  TPSB1,27  [B1,27]
TP273  TPSB2.0  [B2.0]
TP274  TPSB2.0  [B2.0]
TP275  TPSB2.0  [B2.0]
TP276  TPSB2.0  [B2.0]
X16  CON_BMWV2  [24-PIN_V2]
X17  22-23-2051  [22-23-2051]
X18  22-23-2021  [22-23-2021]

### Nets
+10V: 10V6.TP(PP) C58.1 IC57.4(R) IC57.8(V+) IC58.3(A:CD) IC58.5(A:B) IC58.13(B:CD) IC58.16(P:VDD) IC59.1(OUT) R396.2 ; also sheet 1,2,3,4,5,6,7,8,9,10,11
+12V: 24.1 D66.C IC51.16(VDD) IC52.IN IC54.9(CD+) IC56.3(IN) IC59.3(IN) JP26.2 Q36.3(E) Q39.3(E) R363.2 R364.2 R365.2 R366.2 R384.1 R385.1 R390.1 TP275.TP(PP) X16.6 X17.1 ; also sheet 1,2,3,4,5,6,7,8,9,10,11
+12V12: IC60.7(B:OUT) R387.1 R404.1
GND: 23.12 C51.2 C52.2 C53.2 C54.2 C55.2 C56.1 C57.1 C58.2 C59.2 C60.2 D64.1(+) D66.A IC51.8(VSS) IC51.11(D) IC52.GND IC54.8(GND) IC55.10(D:-IN) IC55.11(D:+IN) IC55.12(P:GND) IC56.2(GND) IC56.2@1(GND) IC57.1(GND) IC58.1(A:T1) IC58.4(A:A) IC58.8(P:VSS) IC58.15(B:T1) IC59.2(GND) IC59.2@1(GND) IC60.4(P:V-) Q40.3(E) Q41.2(S) Q42.2(S) R368.1 R374.1 R378.1 R379.2 R381.2 R389.2 R391.2 R394.1 R395.1 R448.1 R450.2 X16.13 X16.18 X16.23 X17.5 X18.1 ; also sheet 1,2,3,4,5,6,7,8,9,10,11
N$1070: R361.2 R363.1
N$1071: 24.9 D60.1(+) D61.1(+) JP28.1 JP29.2 TP272.TP(PP)
N$1072: IC51.10(A) R366.1 X16.4 X17.2
N$1073: IC51.13(B) R365.1 X16.3 X17.3
N$1074: D64.2(-) Q36.2(C) START6.TP(PP) X16.5
N$1075: IC51.12(C) R364.1 X16.2 X17.4
N$1076: 24.7 LED35.A TP270.TP(PP) X16.8
N$1077: 24.2 D62.2(-) LED31.K(C) TP265.TP(PP) X16.12
N$1078: 24.3 D61.2(-) LED32.K(C) TP266.TP(PP) X16.11
N$1079: 24.4 D60.2(-) LED33.K(C) TP267.TP(PP) X16.10
N$1080: 24.8 D63.2(-) LED36.K(C) TP271.TP(PP) X16.14
N$1081: 23.9 D57.1(+) TP262.TP(PP) X16.17
N$1082: 23.11 D58.1(+) TP264.TP(PP) X16.19
N$1083: R367.2 X16.22
N$1084: C54.1 IC60.3(A:+IN) R367.1
N$1085: 24.11 IC54.16(O1) R397.1 R449.2 TP274.TP(PP)
N$1086: IC55.1(B:OUT) R371.2 R376.2
N$1087: C51.1 R371.1 R372.2
N$1088: C52.1 IC55.4(A:-IN) R372.1
N$1089: IC55.5(A:+IN) R373.1 R374.2 R375.2
N$1090: D56.1(+) R375.1
N$1091: C55.1 IC55.9(C:+IN) R378.2 R386.2
N$1092: C56.2 IC55.14(C:OUT) R377.2
N$1093: Q39.1(B) R377.1
N$1094: IC51.2(Q2) IC54.7(I7)
N$1095: 23.5 IC54.12(O5) TP258.TP(PP)
N$1096: IC51.1(Q4) IC54.4(I4)
N$1097: 23.8 Q42.3(D) TP261.TP(PP)
N$1098: 24.10 TP273.TP(PP) X16.15
N$1099: 24.5 D59.2(-) LED34.K(C) TP268.TP(PP) X16.9
N$1100: D59.1(+) R361.1
N$1101: IC51.6(Q5) IC54.3(I3)
N$1102: 23.4 IC54.10(O7) TP257.TP(PP)
N$1103: IC53.1(ADJ) R362.1 R369.2 X16.7
N$1104: IC55.6(B:-IN) IC55.8(C:-IN) R369.1
N$1105: 23.2 Q38.2(C) TP255.TP(PP)
N$1106: 23.1 TP254.TP(PP) X16.1
N$1120: R393.2 X16.16
N$1121: IC51.15(Q3) IC54.5(I5)
N$1122: 23.6 IC54.13(O4) TP259.TP(PP)
N$1123: 23.7 IC54.14(O3) TP260.TP(PP)
N$1124: 24.6 JP27.2 TP269.TP(PP)
N$1125: LED35.K(C) R381.1
N$1126: LED31.A LED32.A LED33.A LED34.A LED36.A R382.1
N$1127: Q36.1(B) R383.2
N$1128: IC51.3(Q0) IC54.1(I1) IC54.2(I2) Q42.1(G)
N$1129: IC51.14(Q1) IC54.6(I6)
N$1130: 23.3 IC54.11(O6) TP256.TP(PP)
N$1131: Q37.1(B) Q37.2(C) Q38.1(B) R379.1 R450.1 X18.2
N$1132: Q38.3(E) R385.2
N$1133: Q37.3(E) R384.2
N$1134: IC55.7(B:+IN) R370.1 R386.1
N$1135: IC60.2(A:-IN) R368.2
N$1136: Q40.1(B) R387.2
N$1137: Q41.3(D) R388.2
N$1138: IC53.2(VO) R362.2
N$1139: IC53.3(VI) Q39.2(C)
N$1140: C57.2 D65.2(-) IC57.2(TR) IC57.6(THR) R391.1
N$1141: IC57.5(CV) R392.2
N$1142: IC57.3(Q) IC58.12(B:A) R392.1
N$1143: D65.1(+) R393.1
N$1144: 23.10 D57.2(-) D58.2(-) JP30.1 SJ6.1 TP263.TP(PP)
N$1145: JP30.2 R394.2 R395.2 SJ6.2
N$1146: IC58.9(B:!Q) IC58.11(B:B) R398.2
N$1147: C59.1 IC58.14(B:T2) R396.1
N$1148: JP26.1 R397.2
N$1149: IC54.15(O2) R383.1
N$1150: 24.12 R398.1 TP276.TP(PP)
N$1151: D62.1(+) JP28.2
N$1152: D56.2(-) IC55.2(A:OUT) JP27.1 Q41.1(G) R390.2
N$1153: IC60.1(A:OUT) R399.2
N$1154: C60.1 R399.1 R400.1
N$1155: IC60.5(B:+IN) R400.2 R404.2
N$1156: IC60.6(B:-IN) R447.1 R448.2
N$1157: D63.1(+) JP29.1
N$1158: JP27.3 R388.1 R389.1
N$1159: IC55.13(D:OUT)
N$1160: R380.1 X16.21
N$1161: Q40.2(C) R380.2 R449.1
VCC: 6V6.TP(PP) C53.1 IC52.OUT IC55.3(P:V+) IC56.1(OUT) IC60.8(P:V+) R370.2 R373.2 R376.1 R382.2 R447.2 ; also sheet 1,2,3,4,5,6,7,8,9,10,11
Unconnected: IC51.4(Q7) IC51.5(Q9) IC51.7(Q6) IC51.9(Q8) IC57.7(DIS) IC58.2(A:T2) IC58.6(A:Q) IC58.7(A:!Q) IC58.10(B:Q) X16.20 X16.24

### Notes on the sheet
- Externe Beschaltung
- Variante "eine LED leuchtet"
- Variante "alle LEDs bis und
   mit Gang X leuchten"
- Anzeige:
- Klemmleisten
  Ausgang:
- Gang 1
- DauerPlus
  Konstant-Strom für LEDs
  Gang 1
  Gang 2
  Gang 3
  Gang 4
  Gang 5
  Neutrallampe
  Blinker rechts
  Blinker zusammen
  Blinker links
  Masse
- Gang 1
- Gang 2
- Gang 2
- Gang 3
- Gang 3
- Gang 1 | Gang 2 | Gang 3 | Gang 4 | Gang 5
- Gang 4
- Gang 4 | Klemmleisten Ausgang:
- Gang 5
- Gang 5
- Zündugsplus
  Choke
  Öldrucklampe
  Temperaturlampe
  Ladekontrolllampe
  Tankgeber (100hm)
  ABS-Lampe
  Lampentest
  Warnlampe
  Fernlichtlampe
  Geschwindigkeitssignal
  Menütaster
- Stromquelle für Gang
  LEDs. Für mehr als 12mA
  muss ein Widerstand "R_user"
  eingelötet werden. Für weniger
  muss der 1kOhm SMD Widerstand
  neben R_user entfernt werden
  I = 12V/1kOhm(default)+12V/R_user
  I= 12mA (default) + 12V/R_user
  Beispiel:
  R_user      Strom in LEDs
  1 kOhm     22-26mA
  ohne       11-13mA
- Externe Beschaltung
- an Zündungsplus anhängen
  (Neutral leuchtet wenn Gang 0
  eingelegt und Zündschlüssel steckt )
- Neutrallampe
  für eigene
  Ganganzeige
- DauerPlus Batterie 12V (rot weiss)
  Ganganzeige Signal C (gelb weiss)
  Ganganzeige Signal B (gelb schwarz)
  Ganganzeige Signal A (gelb dunkelblau)
  12V/350mA zum Starknopf (schwarz grün)
  Zündungsplus 12V (grün schwarz)
  Reservelampe (weiss)
  ABS Leuchte (blau)
  Ladekontrollleuchte (schaltet auf Masse) (violett schwarz)
  Temperaturleuchte (schaltet auf Masse) (braun schwarz)
  Öldruckleuchte (schaltet auf Masse) (braun grün)
  Chokelampe (schaltet auf Masse) (violett weiss)
- BL resistors
- 1k
- an Ausgang "Neutrallampe" anhängen
- Masse (braun)
  Lampentest (schaltet auf Masse)(weiss blau)
  Fernlichtlampe (12V) (weiss)
  Drehzahl Zündspule (schwarz blau)
  Blinker rechts (blau scharz)
  Masse (braun)
  Blinker links (blau rot)
  nicht angeschlossen
  Tachosiganl zum Blinrelais (balu grün)
  Tachogeber (gelb)
  Masse Tachobeger (braun)
  Tachobeleuchtung (12V Zündungsplus) (grau blau)
- RES | BAR
- 4.7V | rising edge trigger A
- ZündungsPlus
- current source 96mA
- 6V regulated for Opamps
- nicht bestückt